# Altium project MB1312.PrjPCB (part 1 of 2)
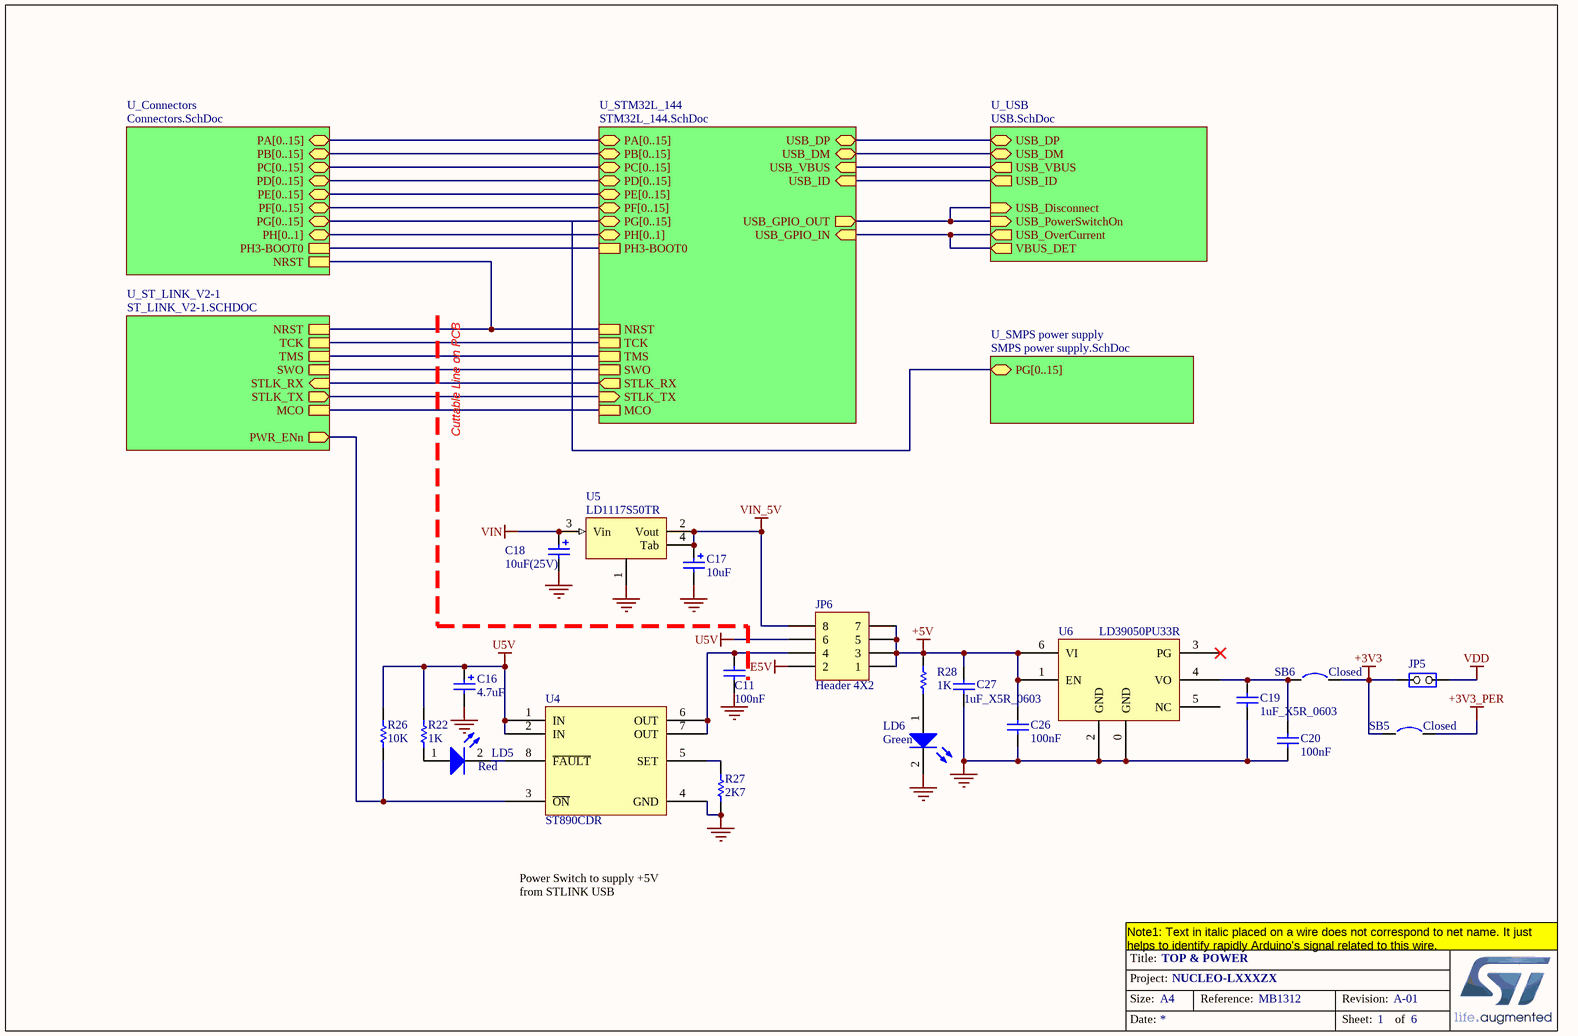
[diagram p0: MB1312.SchDoc]
6 sheets, 297 parts. Net scope: hierarchical (ports join the sheet entries above them; power ports are global).
Sheets:
  MB1312.SchDoc
    U_STM32L_144 = STM32L_144.SchDoc
    U_Connectors = Connectors.SchDoc
    U_ST_LINK_V2-1 = ST_LINK_V2-1.SCHDOC
    U_USB = USB.SchDoc
    U_SMPS power supply = SMPS power supply.SchDoc

## Sheet MB1312.SchDoc: TOP & POWER
size A4; DocumentNumber: MB1312; Revision: A-01; SheetNumber: 1; SheetTotal: 6; Project: NUCLEO-LXXXZX

### Parts
C11  100nF  [0603C]
C16  4.7uF  [TAN-A]
C17  10uF  [TAN-A]
C18  10uF(25V)  [TAN-B]
C19  1uF_X5R_0603  [0603C]
C20  100nF  [0603C]
C26  100nF  [0603C]
C27  1uF_X5R_0603  [0603C]
JP5  (no value)  [HDR_1x2_2R54_V_M_S]
JP6  Header 4X2  [HDR_4x2_2R54_V_M]
LD5  Red  [0603D-R]
LD6  Green  [0603D-G]
R22  1K  [0603R]
R26  10K  [0603R]
R27  2K7  [0603R]
R28  1K  [0603R]
SB5  Closed  [SB_0603]
SB6  Closed  [SB_0603]
U4  ST890CDR  [SOIC8_1R27_4R9X6]
U5  LD1117S50TR  [SOT-223]
U6  LD39050PU33R  [DFN6_0R95_3x3_TP]

### Sub-sheets
U_Connectors = Connectors.SchDoc: PA[0..15] (bidir), PB[0..15] (bidir), PC[0..15] (bidir), NRST, PH3-BOOT0, PD[0..15] (bidir), PE[0..15] (bidir), PF[0..15] (bidir), PG[0..15] (bidir), PH[0..1] (bidir)
U_SMPS power supply = SMPS power supply.SchDoc: PG[0..15] (bidir)
U_ST_LINK_V2-1 = ST_LINK_V2-1.SCHDOC: TMS, TCK, MCO, NRST, STLK_RX (in), STLK_TX (out), SWO, PWR_ENn (out)
U_STM32L_144 = STM32L_144.SchDoc: NRST, MCO, STLK_TX (in), STLK_RX (out), PA[0..15] (bidir), PB[0..15] (bidir), PC[0..15] (bidir), TCK, TMS, SWO, PH3-BOOT0, PD[0..15] (bidir), PE[0..15] (bidir), PF[0..15] (bidir), PG[0..15] (bidir), PH[0..1] (bidir), USB_DM (bidir), USB_DP (bidir), USB_GPIO_OUT (out), USB_GPIO_IN (in), USB_ID (in), USB_VBUS (in)
U_USB = USB.SchDoc: USB_PowerSwitchOn (in), USB_OverCurrent (out), USB_DM (bidir), USB_DP (bidir), USB_ID (out), USB_VBUS (out), USB_Disconnect (in), VBUS_DET (out)

### Nets
+3V3: JP5.1(COMMON) SB5.1 SB6.2
+3V3_PER: SB5.2
+5V: C26.2 C27.1 JP6.1 JP6.3 JP6.5 JP6.7 R28.2 U6.1(EN) U6.6(VI)
E5V: JP6.2
GND: C11.1 C16.2 C17.2 C18.2 C19.2 C20.1 C26.1 C27.2 LD6.2(K) R27.1 U4.4(GND) U5.1 U6.0(GND) U6.2(GND)
U5V: C16.1 JP6.6 R22.1 R26.1 U4.1(IN) U4.2(IN)
VDD: JP5.2(NO)
VIN: C18.1 U5.3(Vin)
VIN_5V: C17.1 JP6.8 U5.2(Vout) U5.4(Tab)
MCO: sheet U_STM32L_144/MCO, sheet U_ST_LINK_V2-1/MCO
NRST: sheet U_STM32L_144/NRST, sheet U_Connectors/NRST, sheet U_ST_LINK_V2-1/NRST
PA13: sheet U_STM32L_144/TMS, sheet U_ST_LINK_V2-1/TMS
PA14: sheet U_STM32L_144/TCK, sheet U_ST_LINK_V2-1/TCK
PB3: sheet U_STM32L_144/SWO, sheet U_ST_LINK_V2-1/SWO
PG6: sheet U_STM32L_144/USB_GPIO_OUT, sheet U_USB/USB_PowerSwitchOn, sheet U_USB/USB_Disconnect
PH3-BOOT0: sheet U_STM32L_144/PH3-BOOT0, sheet U_Connectors/PH3-BOOT0
NetC11_2: C11.2 JP6.4 U4.6(OUT) U4.7(OUT)
NetC19_1: C19.1 C20.2 SB6.1 U6.4(VO)
NetC42_1: sheet U_STM32L_144/USB_VBUS, sheet U_USB/USB_VBUS
NetCN6_1: sheet U_STM32L_144/STLK_RX, sheet U_ST_LINK_V2-1/STLK_RX
NetCN6_2: sheet U_STM32L_144/STLK_TX, sheet U_ST_LINK_V2-1/STLK_TX
NetCN14_2: sheet U_STM32L_144/USB_DM, sheet U_USB/USB_DM
NetCN14_3: sheet U_STM32L_144/USB_DP, sheet U_USB/USB_DP
NetCN14_4: sheet U_STM32L_144/USB_ID, sheet U_USB/USB_ID
NetJP4_1: sheet U_STM32L_144/USB_GPIO_IN, sheet U_USB/USB_OverCurrent, sheet U_USB/VBUS_DET
NetLD5_1: LD5.1(A) R22.2
NetLD5_2: LD5.2(K) U4.8(~{FAULT})
NetLD6_1: LD6.1(A) R28.1
NetR26_2: R26.2 U4.3(~{ON}) ; sheet U_ST_LINK_V2-1/PWR_ENn
NetR27_2: R27.2 U4.5(SET)

Not connected (* = marked no-connect by the designer): U6 3(PG)* 5(NC)

### Buses and harness runs
bus sheet U_Connectors/PA[0..15] = sheet U_STM32L_144/PA[0..15]
bus sheet U_Connectors/PB[0..15] = sheet U_STM32L_144/PB[0..15]
bus sheet U_Connectors/PC[0..15] = sheet U_STM32L_144/PC[0..15]
bus sheet U_Connectors/PD[0..15] = sheet U_STM32L_144/PD[0..15]
bus sheet U_Connectors/PE[0..15] = sheet U_STM32L_144/PE[0..15]
bus sheet U_Connectors/PF[0..15] = sheet U_STM32L_144/PF[0..15]
bus sheet U_Connectors/PG[0..15] = sheet U_SMPS power supply/PG[0..15] = sheet U_STM32L_144/PG[0..15]
bus sheet U_Connectors/PH[0..1] = sheet U_STM32L_144/PH[0..1]

### Notes on the sheet
- Cuttable Line on PCB
- Power Switch to supply +5V from STLINK USB
- Note1: Text in italic placed on a wire does not correspond to net name. It just helps to identify rapidly Arduino's signal related to this wire.
- Title:
- Project:
- Size:
- Date:
- A4
- Reference:
- Sheet:
- Revision:
- of

### Library data of the parts
C11 C20 C26 = Capacitor_ST: Capacitor 0402 / 0603 / 0805; Revision: July-2002: Re-released for DXP Platform.; Value: 100nF
C16 = Cap Pol1: Polarized Capacitor (Radial); Value: 100pF; Ordered by: Subcon; Published: 8-Jun-2000; Revision: July-2002: Re-released for DXP Platform.; Publisher: Altium Limited
C17 C18 = Cap Pol1: Polarized Capacitor (Radial); Published: 8-Jun-2000; Revision: July-2002: Re-released for DXP Platform.; Publisher: Altium Limited; Value: 10uF
C19 C27 = CAP SMD 0603  X5R 1µF 25V 10%: 0603  X5R 1µF; Rated voltage: 25V; Tolerance: 10%; Manufacturer: *; Manufacturer P/N: *; Order code Farnell: 1288202RL; Value: 1µF; Power: *; Technology: X5R; Temperature  Factor: *; Temperature Max: +125°C; Temperature Min: -55°C; STS Code: *
JP5 = JP2
JP6 = Header 4X2: Header, 4-Pin, Dual row; Revision: 17-Jul-2002: Re-released for DXP Platform.; Publisher: Altium Limited
LD5 LD6 = LED2: Typical RED, GREEN, YELLOW, AMBER GaAs LED; Published: 8-Jun-2000; Revision: July-2002: Re-released for DXP Platform.; Publisher: Altium Limited
R22 = Res1: Resistor; Ordered by: Subcon; Published: 8-Jun-2000; Revision: July-2002: Re-released for DXP Platform.; Publisher: Altium Limited; Value: 1K
R26 = Resistor_ST: Resistor 0402 / 0603 / 0805; Description: Resistor 0402 or 0603 or 0805; Value: 10K
R27 R28 = Resistor_ST: Resistor 0402 / 0603 / 0805; Description: Resistor 0402 or 0603 or 0805; Value: 10K
SB5 SB6 = Circuit Breaker_close: Circuit Breaker; Published: 24-Mar-1999; Revision: July-2002: Re-released for DXP Platform.; Publisher: Altium Limited
U5 = LD1117
U6 = LD39050P

## Sheet STM32L_144.SchDoc: MCU
size A3; DocumentNumber: MB1312; Revision: A-01; SheetNumber: 2; SheetTotal: 6; Project: NUCLEO-LXXXZX
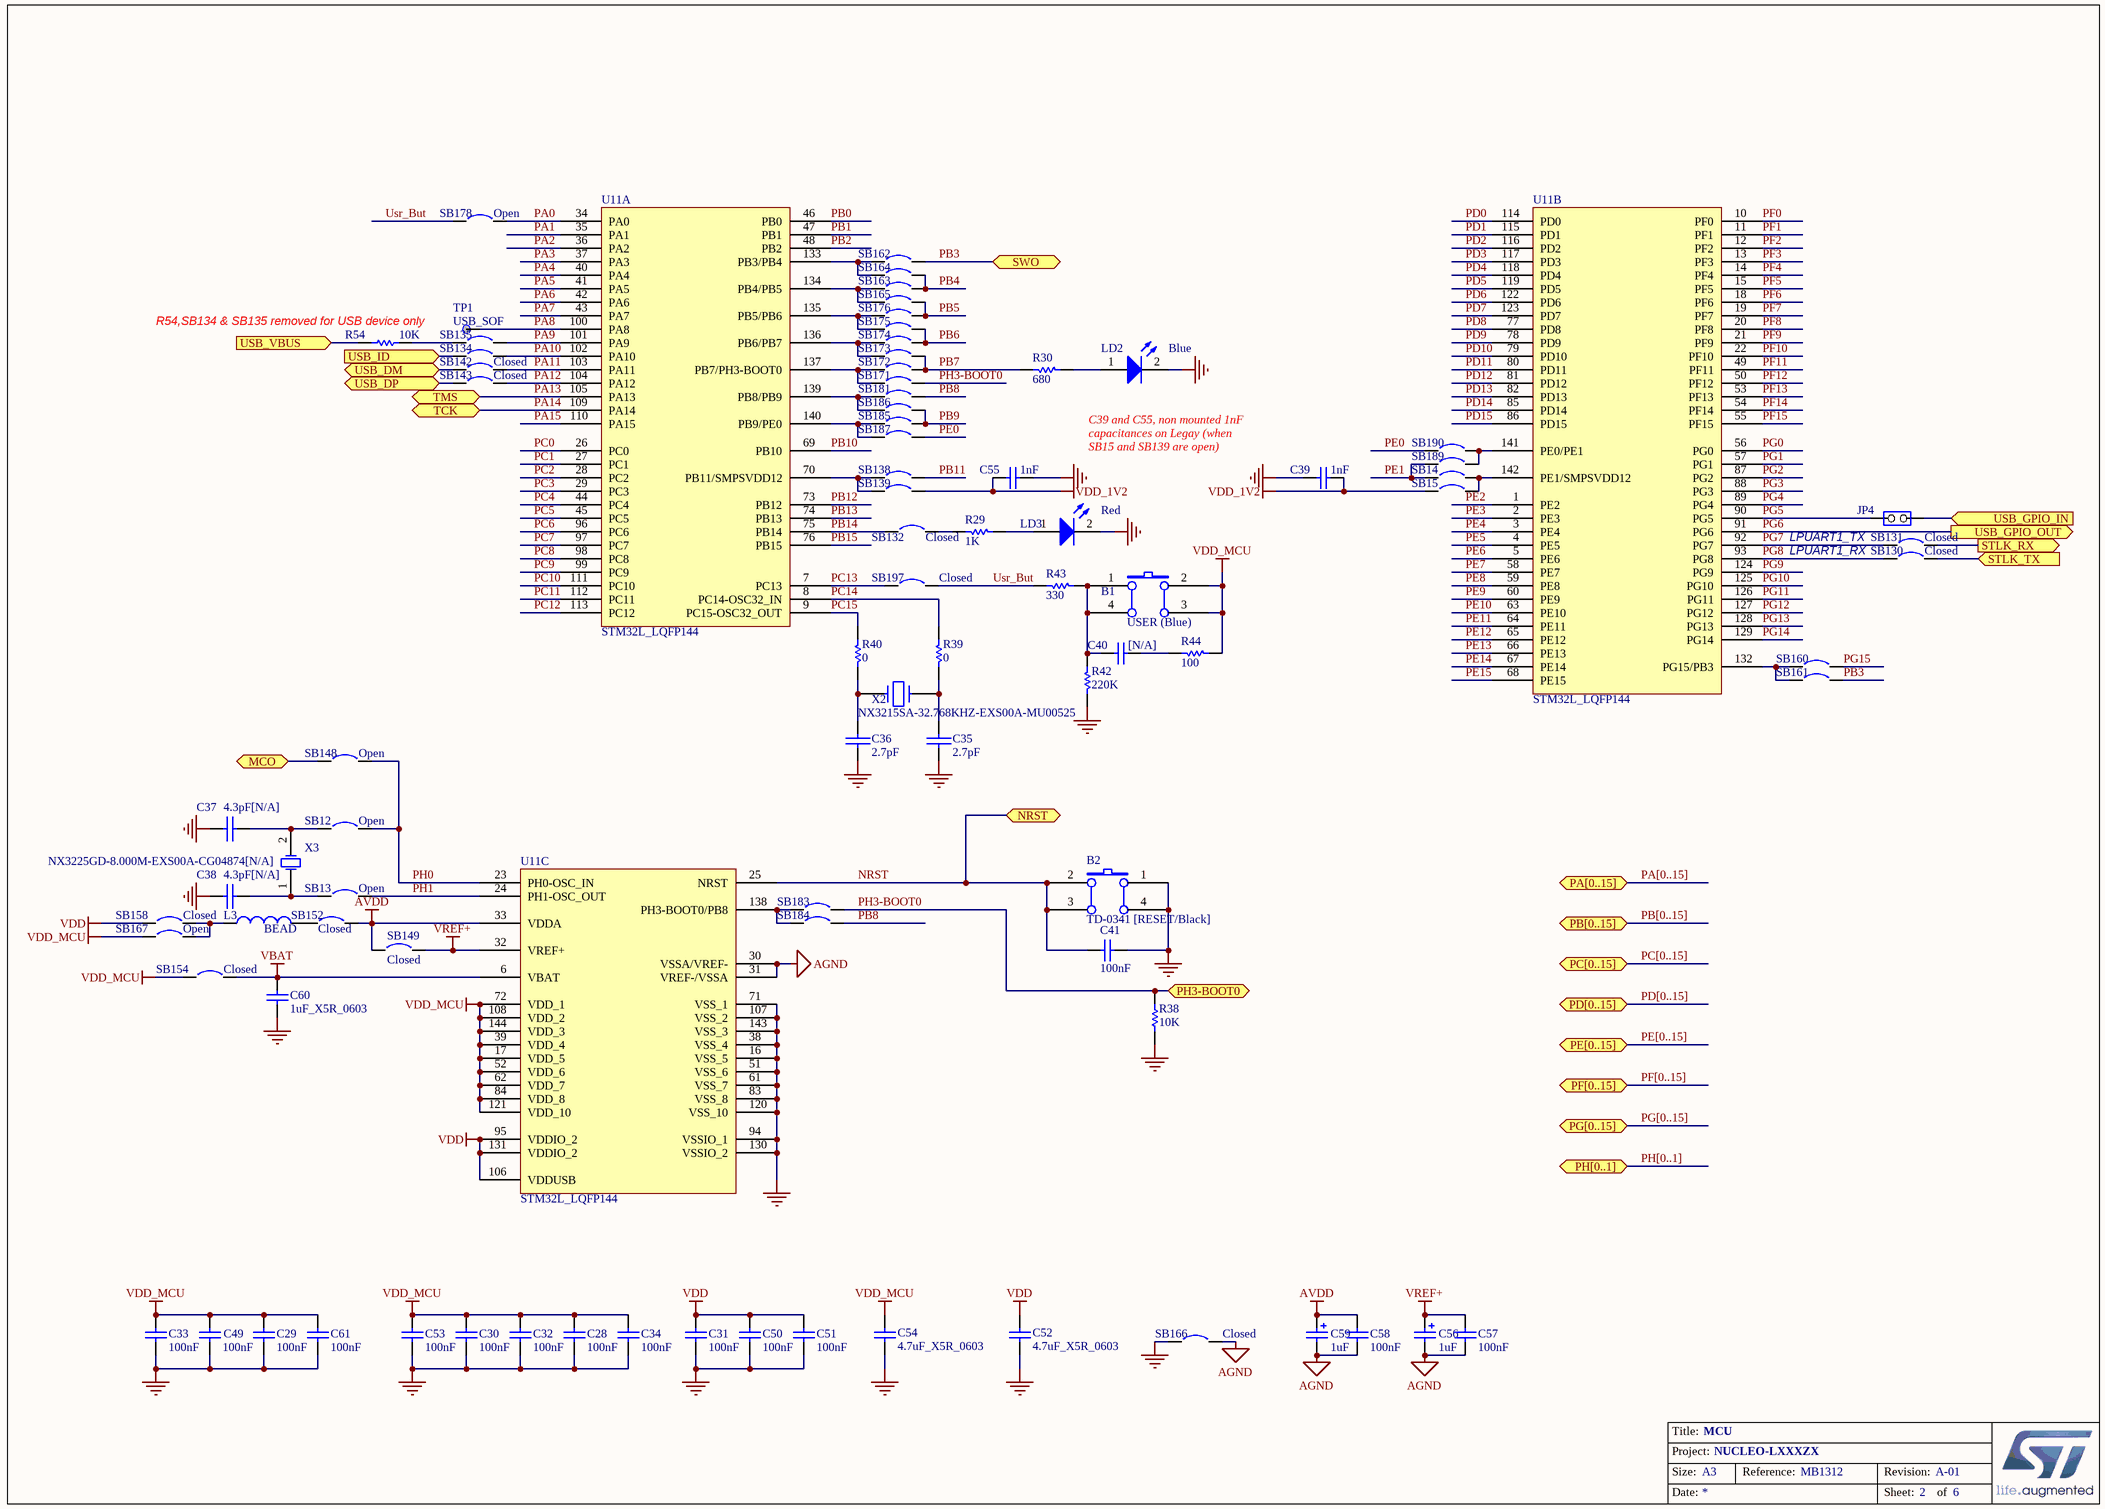
[diagram p1: STM32L_144.SchDoc]

### Parts
B1  USER (Blue)  [PB-6X6mm-Blue]
B2  TD-0341 [RESET/Black]  [PB-6X6mm-Black]
C28  100nF  [0603C]
C29  100nF  [0603C]
C30  100nF  [0603C]
C31  100nF  [0603C]
C32  100nF  [0603C]
C33  100nF  [0603C]
C34  100nF  [0603C]
C35  2.7pF  [0603C]
C36  2.7pF  [0603C]
C37  4.3pF[N/A]  [0603C]
C38  4.3pF[N/A]  [0603C]
C39  1nF  [0603C]
C40  [N/A]  [0603C]
C41  100nF  [0603C]
C49  100nF  [0603C]
C50  100nF  [0603C]
C51  100nF  [0603C]
C52  4.7uF_X5R_0603  [0603C]
C53  100nF  [0603C]
C54  4.7uF_X5R_0603  [0603C]
C55  1nF  [0603C]
C56  value 1uF  [TAN-A]  (hidden comment: TAJA105K016R)
C57  100nF  [0603C]
C58  100nF  [0603C]
C59  value 1uF  [TAN-A]  (hidden comment: TAJA105K016R)
C60  1uF_X5R_0603  [0603C]
C61  100nF  [0603C]
JP4  (no value)  [HDR_1x2_2R54_V_M_S]
L3  BEAD  [0603L]
LD2  Blue  [0603D-B]
LD3  Red  [0603D-R]
R29  1K  [0603R]
R30  680  [0603R]
R38  10K  [0603R]
R39  0  [0603R]
R40  0  [0603R]
R42  220K  [0603R]
R43  330  [0603R]
R44  100  [0603R]
R54  10K  [0603R]
SB12  Open  [SB_0603]
SB13  Open  [SB_0603]
SB14  Circuit Breaker  [SB_0603]  (value not drawn)
SB15  Circuit Breaker  [SB_0603]  (value not drawn)
SB130  Closed  [SB_0603]
SB131  Closed  [SB_0603]
SB132  Closed  [SB_0603]
SB134  Circuit Breaker  [SB_0603]  (value not drawn)
SB135  Circuit Breaker  [SB_0603]  (value not drawn)
SB138  Circuit Breaker  [SB_0603]  (value not drawn)
SB139  Circuit Breaker  [SB_0603]  (value not drawn)
SB142  Closed  [SB_0603]
SB143  Closed  [SB_0603]
SB148  Open  [SB_0603]
SB149  Closed  [SB_0603]
SB152  Closed  [SB_0603]
SB154  Closed  [SB_0603]
SB158  Closed  [SB_0603]
SB160  Circuit Breaker  [SB_0603]  (value not drawn)
SB161  Circuit Breaker  [SB_0603]  (value not drawn)
SB162  Circuit Breaker  [SB_0603]  (value not drawn)
SB163  Circuit Breaker  [SB_0603]  (value not drawn)
SB164  Circuit Breaker  [SB_0603]  (value not drawn)
SB165  Circuit Breaker  [SB_0603]  (value not drawn)
SB166  Closed  [SB_0603]
SB167  Open  [SB_0603]
SB171  Circuit Breaker  [SB_0603]  (value not drawn)
SB172  Circuit Breaker  [SB_0603]  (value not drawn)
SB173  Circuit Breaker  [SB_0603]  (value not drawn)
SB174  Circuit Breaker  [SB_0603]  (value not drawn)
SB175  Circuit Breaker  [SB_0603]  (value not drawn)
SB176  Circuit Breaker  [SB_0603]  (value not drawn)
SB178  Open  [SB_0603]
SB181  Circuit Breaker  [SB_0603]  (value not drawn)
SB183  Circuit Breaker  [SB_0603]  (value not drawn)
SB184  Circuit Breaker  [SB_0603]  (value not drawn)
SB185  Circuit Breaker  [SB_0603]  (value not drawn)
SB186  Circuit Breaker  [SB_0603]  (value not drawn)
SB187  Circuit Breaker  [SB_0603]  (value not drawn)
SB189  Circuit Breaker  [SB_0603]  (value not drawn)
SB190  Circuit Breaker  [SB_0603]  (value not drawn)
SB197  Closed  [SB_0603]
TP1  USB_SOF  [TP]
U11  STM32L_LQFP144  [LQFP144_0R5_SKT]  (parts A,B,C of 3)
X2  NX3215SA-32.768KHZ-EXS00A-MU00525  [XTAL_2SM_3R2X1R5]
X3  NX3225GD-8.000M-EXS00A-CG04874[N/A]  [OSC_2SM_3R2x2R5]

### Ports
MCO, NRST, PA[0..15] (bidir), PB[0..15] (bidir), PC[0..15] (bidir), PD[0..15] (bidir), PE[0..15] (bidir), PF[0..15] (bidir), PG[0..15] (bidir), PH3-BOOT0, PH[0..1] (bidir), STLK_RX (out), STLK_TX (in), SWO, TCK, TMS, USB_DM (bidir), USB_DP (bidir), USB_GPIO_IN (in), USB_GPIO_OUT (out), USB_ID (in), USB_VBUS (in)

### Nets
AGND: C56.2 C57.2 C58.2 C59.2 SB166.2 U11.30(VSSA/VREF-) U11.31(VREF-/VSSA)
AVDD: C58.1 C59.1 SB149.1 SB152.2 U11.33(VDDA)
GND: B2.1(A0) B2.4(A1) C28.2 C29.2 C30.2 C31.2 C32.2 C33.2 C34.2 C35.2 C36.2 C37.2 C38.2 C39.1 C41.1 C49.2 C50.2 C51.2 C52.2 C53.2 C54.2 C55.1 C60.2 C61.2 LD2.2(K) LD3.2(K) R38.2 R42.2 SB166.1 U11.16(VSS_5) U11.38(VSS_4) U11.51(VSS_6) U11.61(VSS_7) U11.71(VSS_1) U11.83(VSS_8) U11.94(VSSIO_1) U11.107(VSS_2) U11.120(VSS_10) U11.130(VSSIO_2) U11.143(VSS_3)
VBAT: C60.1 SB154.2 U11.6(VBAT)
VDD: C31.1 C50.1 C51.1 C52.1 SB158.1 U11.95(VDDIO_2) U11.106(VDDUSB) U11.131(VDDIO_2)
VDD_1V2: C39.2 C55.2 SB15.2 SB139.2
VDD_MCU: B1.2(B0) B1.3(B1) C28.1 C29.1 C30.1 C32.1 C33.1 C34.1 C49.1 C53.1 C54.1 C61.1 R44.1 SB154.1 SB167.1 U11.17(VDD_5) U11.39(VDD_4) U11.52(VDD_6) U11.62(VDD_7) U11.72(VDD_1) U11.84(VDD_8) U11.108(VDD_2) U11.121(VDD_10) U11.144(VDD_3)
VREF+: C56.1 C57.1 SB149.2 U11.32(VREF+)
MCO: SB148.2 ; port MCO
NRST: B2.2(B0) B2.3(B1) C41.2 U11.25(NRST) ; port NRST
PA0: SB178.2 U11.34(PA0)
PA1: U11.35(PA1)
PA2: U11.36(PA2)
PA3: U11.37(PA3)
PA4: U11.40(PA4)
PA5: U11.41(PA5)
PA6: U11.42(PA6)
PA7: U11.43(PA7)
PA8: TP1.1 U11.100(PA8)
PA9: SB135.2 U11.101(PA9)
PA10: SB134.2 U11.102(PA10)
PA11: SB142.2 U11.103(PA11)
PA12: SB143.2 U11.104(PA12)
PA13: U11.105(PA13) ; port TMS
PA14: U11.109(PA14) ; port TCK
PA15: U11.110(PA15)
PB0: U11.46(PB0)
PB1: U11.47(PB1)
PB2: U11.48(PB2)
PB3: SB161.2 SB162.2 ; port SWO
PB4: SB163.2 SB164.2
PB5: SB165.2 SB176.2
PB6: SB174.2 SB175.2
PB7: R30.1 SB172.2 SB173.2
PB8: SB181.2 SB184.2
PB9: SB185.2 SB186.2
PB10: U11.69(PB10)
PB11: SB138.2
PB12: U11.73(PB12)
PB13: U11.74(PB13)
PB14: SB132.1 U11.75(PB14)
PB15: U11.76(PB15)
PC0: U11.26(PC0)
PC1: U11.27(PC1)
PC2: U11.28(PC2)
PC3: U11.29(PC3)
PC4: U11.44(PC4)
PC5: U11.45(PC5)
PC6: U11.96(PC6)
PC7: U11.97(PC7)
PC8: U11.98(PC8)
PC9: U11.99(PC9)
PC10: U11.111(PC10)
PC11: U11.112(PC11)
PC12: U11.113(PC12)
PC13: SB197.1 U11.7(PC13)
PC14: R39.2 U11.8(PC14-OSC32_IN)
PC15: R40.2 U11.9(PC15-OSC32_OUT)
PD0: U11.114(PD0)
PD1: U11.115(PD1)
PD2: U11.116(PD2)
PD3: U11.117(PD3)
PD4: U11.118(PD4)
PD5: U11.119(PD5)
PD6: U11.122(PD6)
PD7: U11.123(PD7)
PD8: U11.77(PD8)
PD9: U11.78(PD9)
PD10: U11.79(PD10)
PD11: U11.80(PD11)
PD12: U11.81(PD12)
PD13: U11.82(PD13)
PD14: U11.85(PD14)
PD15: U11.86(PD15)
PE0: SB187.2 SB190.1
PE1: SB14.1 SB189.1
PE2: U11.1(PE2)
PE3: U11.2(PE3)
PE4: U11.3(PE4)
PE5: U11.4(PE5)
PE6: U11.5(PE6)
PE7: U11.58(PE7)
PE8: U11.59(PE8)
PE9: U11.60(PE9)
PE10: U11.63(PE10)
PE11: U11.64(PE11)
PE12: U11.65(PE12)
PE13: U11.66(PE13)
PE14: U11.67(PE14)
PE15: U11.68(PE15)
PF0: U11.10(PF0)
PF1: U11.11(PF1)
PF2: U11.12(PF2)
PF3: U11.13(PF3)
PF4: U11.14(PF4)
PF5: U11.15(PF5)
PF6: U11.18(PF6)
PF7: U11.19(PF7)
PF8: U11.20(PF8)
PF9: U11.21(PF9)
PF10: U11.22(PF10)
PF11: U11.49(PF11)
PF12: U11.50(PF12)
PF13: U11.53(PF13)
PF14: U11.54(PF14)
PF15: U11.55(PF15)
PG0: U11.56(PG0)
PG1: U11.57(PG1)
PG2: U11.87(PG2)
PG3: U11.88(PG3)
PG4: U11.89(PG4)
PG5: JP4.2(NO) U11.90(PG5)
PG6: U11.91(PG6) ; port USB_GPIO_OUT
PG7: SB131.1 U11.92(PG7)
PG8: SB130.1 U11.93(PG8)
PG9: U11.124(PG9)
PG10: U11.125(PG10)
PG11: U11.126(PG11)
PG12: U11.127(PG12)
PG13: U11.128(PG13)
PG14: U11.129(PG14)
PG15: SB160.2
PH0: SB12.2 SB148.1 U11.23(PH0-OSC_IN)
PH1: SB13.2 U11.24(PH1-OSC_OUT)
PH3-BOOT0: R38.1 SB171.2 SB183.2 ; port PH3-BOOT0
Usr_But: R43.2 SB178.1 SB197.2
NetB1_1: B1.1(A0) B1.4(A1) C40.2 R42.1 R43.1
NetC35_1: C35.1 R39.1 X2.2
NetC36_1: C36.1 R40.1 X2.1
NetC37_1: C37.1 SB12.1 X3.2(OSC2)
NetC38_1: C38.1 SB13.1 X3.1(OSC1)
NetC40_1: C40.1 R44.2
NetC42_1: R54.1 ; port USB_VBUS
NetCN6_1: SB131.2 ; port STLK_RX
NetCN6_2: SB130.2 ; port STLK_TX
NetCN14_2: SB142.1 ; port USB_DM
NetCN14_3: SB143.1 ; port USB_DP
NetCN14_4: SB134.1 ; port USB_ID
NetJP4_1: JP4.1(COMMON) ; port USB_GPIO_IN
NetL3_1: L3.1 SB158.2 SB167.2
NetL3_2: L3.2 SB152.1
NetLD2_1: LD2.1(A) R30.2
NetLD3_1: LD3.1(A) R29.2
NetR29_1: R29.1 SB132.2
NetR54_2: R54.2 SB135.1
NetSB14_2: SB14.2 SB15.1 U11.142(PE1/SMPSVDD12)
NetSB138_1: SB138.1 SB139.1 U11.70(PB11/SMPSVDD12)
NetSB160_1: SB160.1 SB161.1 U11.132(PG15/PB3)
NetSB162_1: SB162.1 SB164.1 U11.133(PB3/PB4)
NetSB163_1: SB163.1 SB165.1 U11.134(PB4/PB5)
NetSB171_1: SB171.1 SB172.1 U11.137(PB7/PH3-BOOT0)
NetSB173_1: SB173.1 SB174.1 U11.136(PB6/PB7)
NetSB175_1: SB175.1 SB176.1 U11.135(PB5/PB6)
NetSB181_1: SB181.1 SB186.1 U11.139(PB8/PB9)
NetSB183_1: SB183.1 SB184.1 U11.138(PH3-BOOT0/PB8)
NetSB185_1: SB185.1 SB187.1 U11.140(PB9/PE0)
NetSB189_2: SB189.2 SB190.2 U11.141(PE0/PE1)

### Buses and harness runs
bus PA[0..15] = port PA[0..15]
bus PB[0..15] = port PB[0..15]
bus PC[0..15] = port PC[0..15]
bus PD[0..15] = port PD[0..15]
bus PE[0..15] = port PE[0..15]
bus PF[0..15] = port PF[0..15]
bus PG[0..15] = port PG[0..15]
bus PH[0..1] = port PH[0..1]

### Notes on the sheet
- (near R54) R54,SB134 & SB135 removed for USB device only
- C39 and C55, non mounted 1nF capacitances on Legay (when SB15 and SB139 are open)
- LPUART1_TX
- LPUART1_RX
- Title:
- Project:
- Size:
- Date:
- A3
- Reference:
- Sheet:
- Revision:
- of

### Library data of the parts
B1 B2 = SW PUSHBUTTON: SE PUSHBUTTON
C28-C34 C39 C49-C51 C53 C55 C57 C58 C61 = Cap: Capacitor; Value: 10nF; Published: 8-Jun-2000; Revision: July-2002: Re-released for DXP Platform.; Publisher: Altium Limited
C35-C38 = CAP: Capacitor
C40 C41 = CAP: Capacitor; Value: 100pF; Published: 8-Jun-2000; Revision: July-2002: Re-released for DXP Platform.; Publisher: Altium Limited
C52 C54 = CAP SMD 0603  X5R 1µF 25V 10%: 0603  X5R 4.7uF; Value: 1µF; Rated voltage: 25V; Tolerance: 10%; Manufacturer: *; Manufacturer P/N: *; Order code Farnell: 1288202RL; Power: *; Technology: X5R; Temperature  Factor: *; Temperature Max: +125°C; Temperature Min: -55°C; STS Code: *
C56 C59 = Cap Pol1: Tan Capacitor,1uF,10%,16V,Tan-A,TAJA105K016R; Manuf_1: AVX; Ordered by: Subcon; ECCN_US/EU: NA; Published: 8-Jun-2000; Revision: July-2002: Re-released for DXP Platform.; Publisher: Altium Limited; Manuf_Part_1: TAJA105K016R
C60 = CAP SMD 0603  X5R 1µF 25V 10%: as C19 on sheet MB1312; Manufacturer: *; Manufacturer P/N: *; Order code Farnell: 1288202RL; Value: 1µF; Power: *; Technology: X5R; Temperature  Factor: *; Temperature Max: +125°C; Temperature Min: -55°C; STS Code: *
JP4 = JP2
L3 = Inductor: Value: 100uH; Published: 8-Jun-2000; Revision: July-2002: Re-released for DXP Platform.; Publisher: Altium Limited
LD2 LD3 = LED2: as LD5 on sheet MB1312; Published: 8-Jun-2000; Revision: July-2002: Re-released for DXP Platform.; Publisher: Altium Limited
R29 = Res1: Resistor; Published: 8-Jun-2000; Revision: July-2002: Re-released for DXP Platform.; Publisher: Altium Limited; Value: 1K
R30 R39 R40 R43 R44 = Res1: Resistor; Value: 1K; Published: 8-Jun-2000; Revision: July-2002: Re-released for DXP Platform.; Publisher: Altium Limited
R38 R42 = res1: Resistor; Value: 1K; Published: 8-Jun-2000; Revision: July-2002: Re-released for DXP Platform.; Publisher: Altium Limited
R54 = Resistor_ST: Resistor 0402 / 0603 / 0805; Value: 10K
SB12 SB13 SB148 SB167 SB178 = Circuit Breaker: Published: 24-Mar-1999; Revision: July-2002: Re-released for DXP Platform.; Publisher: Altium Limited
SB14 SB15 SB134 SB135 SB138 SB139 SB160-SB165 SB171-SB176 SB181 SB183-SB187 SB189 SB190 = Circuit Breaker: Solder: NO; Published: 24-Mar-1999; Revision: July-2002: Re-released for DXP Platform.; Publisher: Altium Limited
SB130-SB132 SB142 SB143 SB149 SB152 SB154 SB158 SB166 SB197 = Circuit Breaker_close: Circuit Breaker; Published: 24-Mar-1999; Revision: July-2002: Re-released for DXP Platform.; Publisher: Altium Limited
TP1 = TP
X2 = CRYSTAL_32K: Crystal
X3 = XTAL: Crystal Oscillator; Published: 8-Jun-2000; LatestRevisionDate: 17-Jul-2002; LatestRevisionNote: Re-released for DXP Platform.; PackageReference: R38; Publisher: Altium Limited

## Sheet Connectors.SchDoc: Extension connectors
size A3; DocumentNumber: MB1312; Revision: A-01; SheetNumber: 5; SheetTotal: 6; Project: NUCLEO-LXXXZX
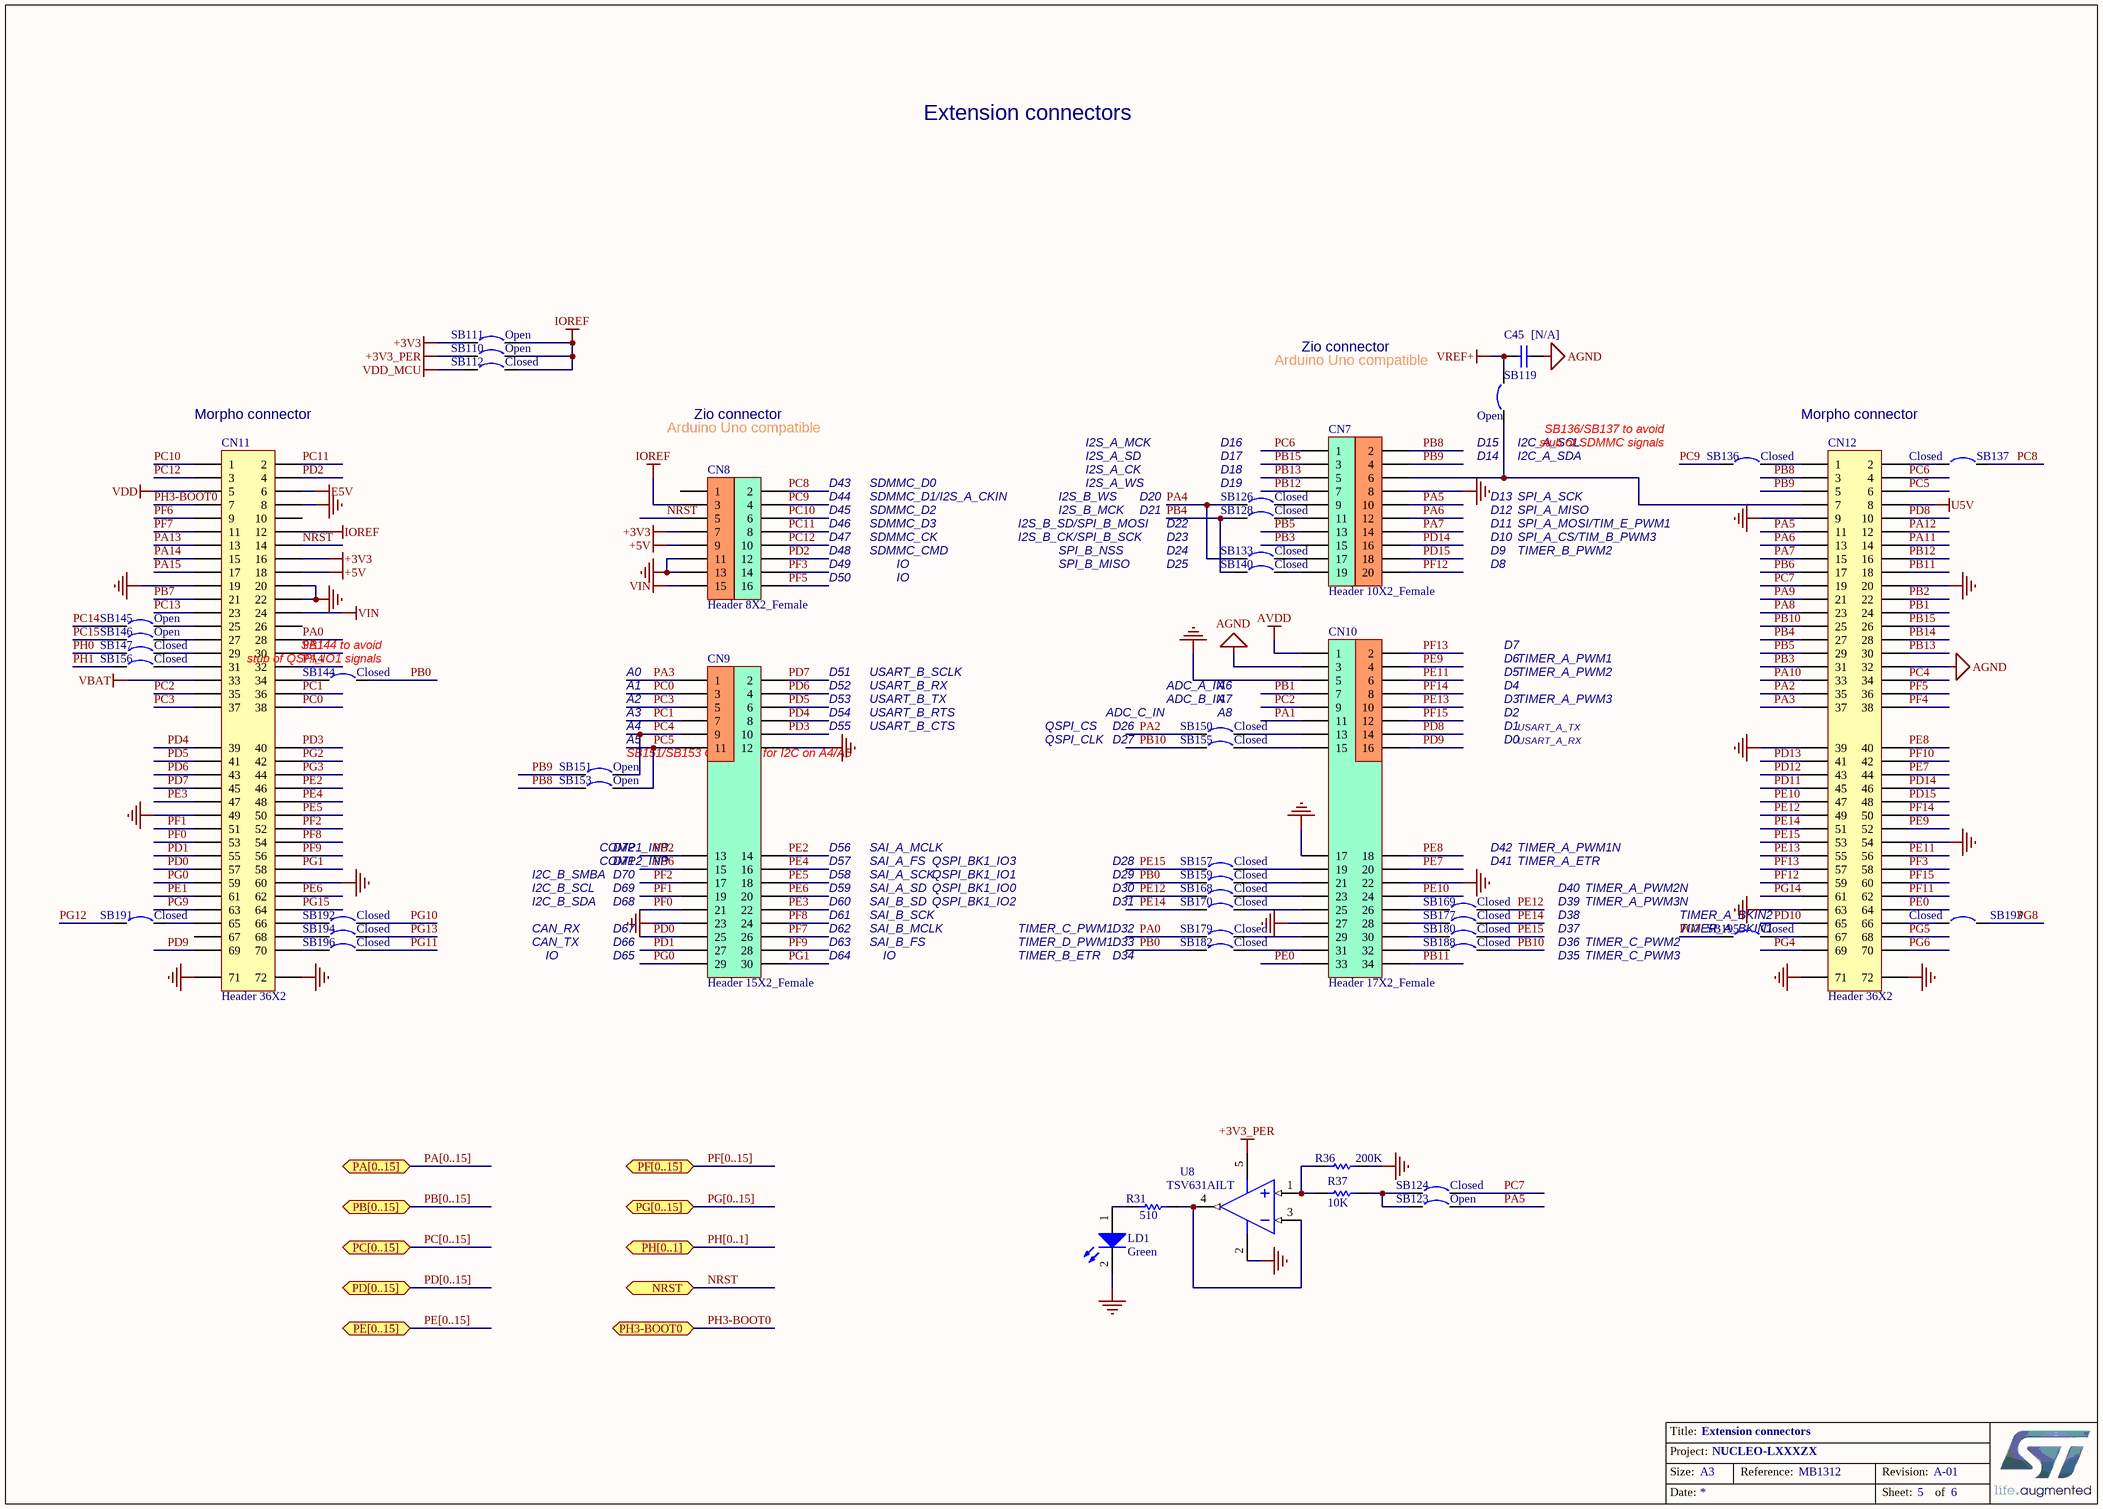
[diagram p2: Connectors.SchDoc]

### Parts
C45  [N/A]  [0603C]
CN7  Header 10X2_Female  [HDR_10x2_2R54_V_F]
CN8  Header 8X2_Female  [HDR_8x2_2R54_V_F]
CN9  Header 15X2_Female  [HDR_15x2_2R54_V_F]
CN10  Header 17X2_Female  [HDR_17x2_2R54_V_F]
CN11  Header 36X2  [HDR_2x36_2R54_V_M]
CN12  Header 36X2  [HDR_2x36_2R54_V_M]
LD1  Green  [0603D-G]
R31  510  [0603R]
R36  200K  [0603R]
R37  10K  [0603R]
SB110  Open  [SB_0603]
SB111  Open  [SB_0603]
SB112  Closed  [SB_0603]
SB119  Open  [SB_0603]
SB123  Open  [SB_0603]
SB124  Closed  [SB_0603]
SB126  Closed  [SB_0603]
SB128  Closed  [SB_0603]
SB133  Closed  [SB_0603]
SB136  Closed  [SB_0603]
SB137  Closed  [SB_0603]
SB140  Closed  [SB_0603]
SB144  Closed  [SB_0603]
SB145  Open  [SB_0603]
SB146  Open  [SB_0603]
SB147  Closed  [SB_0603]
SB150  Closed  [SB_0603]
SB151  Open  [SB_0603]
SB153  Open  [SB_0603]
SB155  Closed  [SB_0603]
SB156  Closed  [SB_0603]
SB157  Closed  [SB_0603]
SB159  Closed  [SB_0603]
SB168  Closed  [SB_0603]
SB169  Closed  [SB_0603]
SB170  Closed  [SB_0603]
SB177  Closed  [SB_0603]
SB179  Closed  [SB_0603]
SB180  Closed  [SB_0603]
SB182  Closed  [SB_0603]
SB188  Closed  [SB_0603]
SB191  Closed  [SB_0603]
SB192  Closed  [SB_0603]
SB193  Closed  [SB_0603]
SB194  Closed  [SB_0603]
SB195  Closed  [SB_0603]
SB196  Closed  [SB_0603]
U8  TSV631AILT  [SOT-23-5L]

### Ports
NRST, PA[0..15] (bidir), PB[0..15] (bidir), PC[0..15] (bidir), PD[0..15] (bidir), PE[0..15] (bidir), PF[0..15] (bidir), PG[0..15] (bidir), PH3-BOOT0, PH[0..1] (bidir)

### Nets
+3V3: CN8.7 CN11.16 SB111.1
+3V3_PER: SB110.1 U8.5(VCC)
+5V: CN8.9 CN11.18
AGND: C45.2 CN10.3 CN12.32
AVDD: CN10.1
E5V: CN11.6
GND: CN7.8 CN8.11 CN8.13 CN9.12 CN9.23 CN10.5 CN10.17 CN10.22 CN10.27 CN11.8 CN11.19 CN11.20 CN11.22 CN11.49 CN11.60 CN11.71 CN11.72 CN12.9 CN12.20 CN12.39 CN12.54 CN12.63 CN12.71 CN12.72 LD1.2(K) R36.2 U8.2(VDD)
IOREF: CN8.3 CN11.12 SB110.2 SB111.2 SB112.2
U5V: CN12.8
VBAT: CN11.33
VDD: CN11.5
VDD_MCU: SB112.1
VIN: CN8.15 CN11.24
VREF+: C45.1 SB119.1
NRST: CN8.5 CN11.14 ; port NRST
PA0: CN11.28 SB179.1
PA1: CN10.11 CN11.30
PA2: CN12.35 SB150.1
PA3: CN9.1 CN12.37
PA4: CN11.32 SB126.1 SB133.1
PA5: CN7.10 CN12.11 SB123.2
PA6: CN7.12 CN12.13
PA7: CN7.14 CN12.15
PA8: CN12.23
PA9: CN12.21
PA10: CN12.33
PA11: CN12.14
PA12: CN12.12
PA13: CN11.13
PA14: CN11.15
PA15: CN11.17
PB0: SB144.2 SB159.1 SB182.1
PB1: CN10.7 CN12.24
PB2: CN9.13 CN12.22
PB3: CN7.15 CN12.31
PB4: CN12.27 SB128.1 SB140.1
PB5: CN7.13 CN12.29
PB6: CN9.15 CN12.17
PB7: CN11.21
PB8: CN7.2 CN12.3 SB153.2
PB9: CN7.4 CN12.5 SB151.2
PB10: CN12.25 SB155.1 SB188.2
PB11: CN10.34 CN12.18
PB12: CN7.7 CN12.16
PB13: CN7.5 CN12.30
PB14: CN12.28
PB15: CN7.3 CN12.26
PC0: CN9.3 CN11.38
PC1: CN9.7 CN11.36
PC2: CN10.9 CN11.35
PC3: CN9.5 CN11.37
PC4: CN9.9 CN12.34 SB151.1
PC5: CN9.11 CN12.6 SB153.1
PC6: CN7.1 CN12.4
PC7: CN12.19 SB124.1
PC8: CN8.2 SB137.1
PC9: CN8.4 SB136.1
PC10: CN8.6 CN11.1
PC11: CN8.8 CN11.2
PC12: CN8.10 CN11.3
PC13: CN11.23
PC14: SB145.1
PC15: SB146.1
PD0: CN9.25 CN11.57
PD1: CN9.27 CN11.55
PD2: CN8.12 CN11.4
PD3: CN9.10 CN11.40
PD4: CN9.8 CN11.39
PD5: CN9.6 CN11.41
PD6: CN9.4 CN11.43
PD7: CN9.2 CN11.45
PD8: CN10.14 CN12.10
PD9: CN10.16 CN11.69
PD10: CN12.65
PD11: CN12.45
PD12: CN12.43
PD13: CN12.41
PD14: CN7.16 CN12.46
PD15: CN7.18 CN12.48
PE0: CN10.33 CN12.64
PE1: CN11.61
PE2: CN9.14 CN11.46
PE3: CN9.22 CN11.47
PE4: CN9.16 CN11.48
PE5: CN9.18 CN11.50
PE6: CN9.20 CN11.62
PE7: CN10.20 CN12.44
PE8: CN10.18 CN12.40
PE9: CN10.4 CN12.52
PE10: CN10.24 CN12.47
PE11: CN10.6 CN12.56
PE12: CN12.49 SB168.1 SB169.2
PE13: CN10.10 CN12.55
PE14: CN12.51 SB170.1 SB177.2
PE15: CN12.53 SB157.1 SB180.2
PF0: CN9.21 CN11.53
PF1: CN9.19 CN11.51
PF2: CN9.17 CN11.52
PF3: CN8.14 CN12.58
PF4: CN12.38
PF5: CN8.16 CN12.36
PF6: CN11.9
PF7: CN9.26 CN11.11
PF8: CN9.24 CN11.54
PF9: CN9.28 CN11.56
PF10: CN12.42
PF11: CN12.62
PF12: CN7.20 CN12.59
PF13: CN10.2 CN12.57
PF14: CN10.8 CN12.50
PF15: CN10.12 CN12.60
PG0: CN9.29 CN11.59
PG1: CN9.30 CN11.58
PG2: CN11.42
PG3: CN11.44
PG4: CN12.69
PG5: CN12.68
PG6: CN12.70
PG7: SB195.1
PG8: SB193.2
PG9: CN11.63
PG10: SB192.2
PG11: SB196.2
PG12: SB191.1
PG13: SB194.2
PG14: CN12.61
PG15: CN11.64
PH0: SB147.1
PH1: SB156.1
PH3-BOOT0: CN11.7 ; port PH3-BOOT0
NetCN7_6: CN7.6 CN12.7 SB119.2
NetCN7_9: CN7.9 SB126.2
NetCN7_11: CN7.11 SB128.2
NetCN7_17: CN7.17 SB133.2
NetCN7_19: CN7.19 SB140.2
NetCN10_13: CN10.13 SB150.2
NetCN10_15: CN10.15 SB155.2
NetCN10_19: CN10.19 SB157.2
NetCN10_21: CN10.21 SB159.2
NetCN10_23: CN10.23 SB168.2
NetCN10_25: CN10.25 SB170.2
NetCN10_26: CN10.26 SB169.1
NetCN10_28: CN10.28 SB177.1
NetCN10_29: CN10.29 SB179.2
NetCN10_30: CN10.30 SB180.1
NetCN10_31: CN10.31 SB182.2
NetCN10_32: CN10.32 SB188.1
NetCN11_25: CN11.25 SB145.2
NetCN11_27: CN11.27 SB146.2
NetCN11_29: CN11.29 SB147.2
NetCN11_31: CN11.31 SB156.2
NetCN11_34: CN11.34 SB144.1
NetCN11_65: CN11.65 SB191.2
NetCN11_66: CN11.66 SB192.1
NetCN11_68: CN11.68 SB194.1
NetCN11_70: CN11.70 SB196.1
NetCN12_1: CN12.1 SB136.2
NetCN12_2: CN12.2 SB137.2
NetCN12_66: CN12.66 SB193.1
NetCN12_67: CN12.67 SB195.2
NetLD1_1: LD1.1(A) R31.2
NetR31_1: R31.1 U8.3(IN-) U8.4(OUT)
NetR36_1: R36.1 R37.1 U8.1(IN+)
NetR37_2: R37.2 SB123.1 SB124.2

Not connected (* = marked no-connect by the designer): CN8 1; CN11 10 26 67

### Buses and harness runs
bus PA[0..15] = port PA[0..15]
bus PB[0..15] = port PB[0..15]
bus PC[0..15] = port PC[0..15]
bus PD[0..15] = port PD[0..15]
bus PE[0..15] = port PE[0..15]
bus PF[0..15] = port PF[0..15]
bus PG[0..15] = port PG[0..15]
bus PH[0..1] = port PH[0..1]

### Notes on the sheet
- Extension connectors
- Arduino Uno compatible
- Zio connector
- (near CN11) Morpho connector
- I2S_A_MCK
- D16
- (near SB119) D15
- (near SB119) I2C_A_SCL
- (near SB136) SB136/SB137 to avoid
- (near SB136) stub of SDMMC signals
- Morpho connector
- D43
- D44
- D45
- SDMMC_D0
- SDMMC_D1/I2S_A_CKIN
- SDMMC_D2
- I2S_B_WS
- I2S_B_MCK
- I2S_A_SD
- I2S_A_CK
- I2S_A_WS
- D20
- D21
- D17
- D18
- (near SB126) D19
- (near SB119) D14
- D13
- D12
- SPI_A_SCK
- SPI_A_MISO
- (near SB119) I2C_A_SDA
- D46
- D47
- D48
- D49
- D50
- SDMMC_CK
- SDMMC_CMD
- SDMMC_D3
- IO
- I2S_B_SD/SPI_B_MOSI
- I2S_B_CK/SPI_B_SCK
- SPI_B_MISO
- SPI_B_NSS
- D22
- D23
- D24
- D25
- D8
- D9
- D10
- D11
- TIMER_B_PWM2
- SPI_A_CS/TIM_B_PWM3
- SPI_A_MOSI/TIM_E_PWM1
- (near SB144) SB144 to avoid
- D7
- (near SB144) stub of QSPI_IO1 signals
- A0
- A1
- A2
- A3
- D51
- D52
- D53
- D54
- USART_B_TX
- USART_B_RX
- USART_B_SCLK
- USART_B_RTS
- ADC_A_IN
- ADC_B_IN
- (near SB150) ADC_C_IN
- A6
- A7
- (near SB150) A8
- D2
- D4
- D3
- D5
- D6
- TIMER_A_PWM1
- TIMER_A_PWM2
- TIMER_A_PWM3
- A4
- A5
- (near SB151) SB151/SB153 Close only for I2C on A4/A5
- D55
- USART_B_CTS
- QSPI_CLK
- QSPI_CS
- D26
- D27
- D0
- D1
- USART_A_TX
- USART_A_RX
- COMP1_INP
- D72
- D56
- SAI_A_MCLK
- D42
- TIMER_A_PWM1N
- I2C_B_SCL
- I2C_B_SDA
- I2C_B_SMBA
- COMP2_INP
- D71
- D70
- D69
- D68
- D57
- D58
- D59
- D60
- D61
- SAI_A_SD
- SAI_A_SCK
- SAI_A_FS
- SAI_B_SD
- SAI_B_SCK
- QSPI_BK1_IO0
- QSPI_BK1_IO2
- QSPI_BK1_IO1
- QSPI_BK1_IO3
- D28
- D29
- D30
- D31
- D41
- TIMER_A_ETR
- D38
- D39
- D40
- TIMER_A_PWM2N
- TIMER_A_PWM3N
- TIMER_A_BKIN2
- CAN_TX
- CAN_RX
- D67
- D66
- D65
- D62
- D63
- D64
- SAI_B_FS
- SAI_B_MCLK
- TIMER_D_PWM1
- TIMER_B_ETR
- TIMER_C_PWM1
- D32
- D33
- D34
- D35
- D36
- D37
- TIMER_C_PWM2
- TIMER_C_PWM3
- TIMER_A_BKIN1
- Title:
- Project:
- Size:
- Date:
- Reference:
- Sheet:
- Revision:
- of

### Library data of the parts
C45 = Cap: Capacitor,100nF,10%,16V,X7R,0603,YAGEO; Manuf_Part_1: CC0603KRX7R7BB104; Ordered by: Subcon; Published: 8-Jun-2000; Revision: July-2002: Re-released for DXP Platform.; Publisher: Altium Limited; Value: 100nF; Manuf_1: YAGEO
CN7 = Header 10X2_Female: Header, 10-Pin, Dual row,female; LatestRevisionDate: 17-Jul-2002; LatestRevisionNote: Re-released for DXP Platform.; Publisher: Altium Limited
CN8 = Header 8X2_Female: Header, 8-Pin, Dual row,female; LatestRevisionDate: 17-Jul-2002; LatestRevisionNote: Re-released for DXP Platform.; Publisher: Altium Limited
CN9 = Header 15X2_Female: Header, 15-Pin, Dual row,female; Revision: 17-Jul-2002: Re-released for DXP Platform.; Publisher: Altium Limited
CN10 = Header 17X2_Female: Header, 17-Pin, Dual row,female; Revision: 17-Jul-2002: Re-released for DXP Platform.; Publisher: Altium Limited
CN11 CN12 = Header 36X2: Header, 36-Pin, Dual row; Revision: 17-Jul-2002: Re-released for DXP Platform.; Publisher: Altium Limited
LD1 = LED2: as LD5 on sheet MB1312; Published: 8-Jun-2000; Revision: July-2002: Re-released for DXP Platform.; Publisher: Altium Limited
R31 = Res1: Resistor; Value: 1K; Published: 8-Jun-2000; Revision: July-2002: Re-released for DXP Platform.; Publisher: Altium Limited
R36 R37 = res1: Resistor; Value: 1K; Published: 8-Jun-2000; Revision: July-2002: Re-released for DXP Platform.; Publisher: Altium Limited
SB110 SB111 SB119 SB123 SB145 SB146 SB151 SB153 = Circuit Breaker: Published: 24-Mar-1999; Revision: July-2002: Re-released for DXP Platform.; Publisher: Altium Limited
SB112 SB124 SB126 SB128 SB133 SB136 SB137 SB140 SB144 SB147 SB150 SB155-SB157 SB159 SB168-SB170 SB177 SB179 SB180 SB182 SB188 SB191-SB196 = Circuit Breaker_close: Circuit Breaker; Published: 24-Mar-1999; Revision: July-2002: Re-released for DXP Platform.; Publisher: Altium Limited

## Sheet ST_LINK_V2-1.SCHDOC: STLINK/V2-1
size A4; DocumentNumber: MB1312; Revision: A-01; SheetNumber: 3; SheetTotal: 6; Project: NUCLEO-LXXXZX
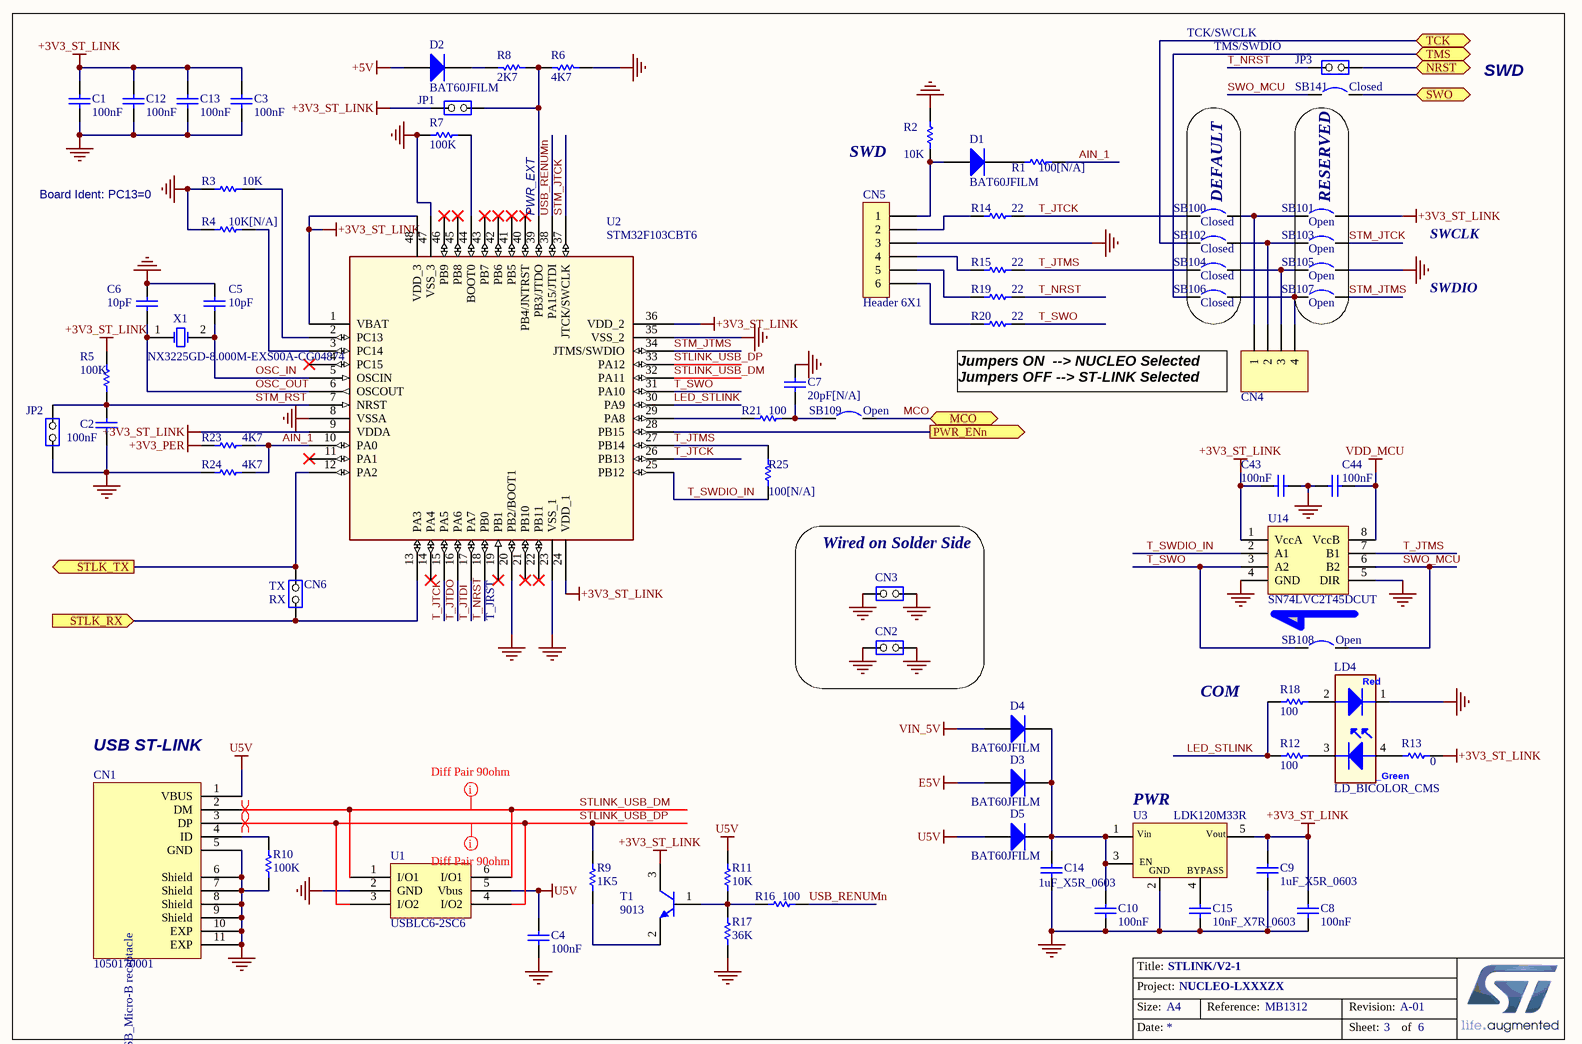
[diagram p3: ST_LINK_V2-1.SCHDOC]

### Parts
C1  100nF  [0603C]
C2  100nF  [0603C]
C3  100nF  [0603C]
C4  100nF  [0603C]
C5  10pF  [0603C]
C6  10pF  [0603C]
C7  20pF[N/A]  [0603C]
C8  100nF  [0603C]
C9  1uF_X5R_0603  [0603C]
C10  100nF  [0603C]
C12  100nF  [0603C]
C13  100nF  [0603C]
C14  1uF_X5R_0603  [0603C]
C15  10nF_X7R_0603  [0603C]
C43  value 100nF  [0603C]  (hidden comment: CC0603KRX7R7BB104)
C44  value 100nF  [0603C]  (hidden comment: CC0603KRX7R7BB104)
CN1  1050170001  [Molex_1050170001]
CN2  (no value)  [HDR_1x2_2R54_V_M]
CN3  (no value)  [HDR_1x2_2R54_V_M]
CN4  Header 4  [HDR_1x4_2R54_V_M]  (value not drawn)
CN5  Header 6X1  [HDR_1x6_2R54_V_M]
CN6  (no value)  [HDR_1x2_2R54_V_M_S]
D1  BAT60JFILM  [SOD-323]
D2  BAT60JFILM  [SOD-323]
D3  BAT60JFILM  [SOD-323]
D4  BAT60JFILM  [SOD-323]
D5  BAT60JFILM  [SOD-323]
JP1  (no value)  [HDR_1x2_2R54_V_M_S]
JP2  (no value)  [HDR_1x2_2R54_V_M_S]
JP3  (no value)  [HDR_1x2_2R54_V_M_S]
LD4  LD_BICOLOR_CMS  [HSMF-A201]
R1  100[N/A]  [0603R]
R2  10K  [0603R]
R3  10K  [0603R]
R4  10K[N/A]  [0603R]
R5  100K  [0603R]
R6  4K7  [0603R]
R7  100K  [0603R]
R8  2K7  [0603R]
R9  1K5  [0603R]
R10  100K  [0603R]
R11  10K  [0603R]
R12  100  [0603R]
R13  0  [0603R]
R14  22  [0603R]
R15  22  [0603R]
R16  100  [0603R]
R17  36K  [0603R]
R18  100  [0603R]
R19  22  [0603R]
R20  22  [0603R]
R21  100  [0603R]
R23  4K7  [0603R]
R24  4K7  [0603R]
R25  100[N/A]  [0603R]
SB100  Closed  [SB_0603]
SB101  Open  [SB_0603]
SB102  Closed  [SB_0603]
SB103  Open  [SB_0603]
SB104  Closed  [SB_0603]
SB105  Open  [SB_0603]
SB106  Closed  [SB_0603]
SB107  Open  [SB_0603]
SB108  Open  [SB_0603]
SB109  Open  [SB_0603]
SB141  Closed  [SB_0603]
T1  9013  [SOT-23]
U1  USBLC6-2SC6  [SOT23-6L]
U2  STM32F103CBT6  [LQFP48_0R5_7x7]
U3  LDK120M33R  [SOT23-5]
U14  SN74LVC2T45DCUT  [USOP8_0R5_2X3R1]
X1  NX3225GD-8.000M-EXS00A-CG04874  [OSC_2SM_3R2x2R5]

### Blocks framed on the sheet
DEFAULT: SB100 SB102 SB104 SB106
RESERVED: SB101 SB103 SB105 SB107
Wired on Solder Side: CN2 CN3

### Ports
MCO, NRST, PWR_ENn (out), STLK_RX (in), STLK_TX (out), SWO, TCK, TMS

### Nets
+3V3_PER: R23.1
+3V3_ST_LINK: C1.2 C3.2 C8.2 C9.1 C12.2 C13.2 C43.2 JP1.1(COMMON) R5.2 R13.2 SB101.2 T1.3(C) U2.1(VBAT) U2.9(VDDA) U2.24(VDD_1) U2.36(VDD_2) U2.48(VDD_3) U3.5(Vout) U14.1(VccA)
+5V: D2.1(A)
E5V: D3.1(A)
GND: C1.1 C2.1 C3.1 C4.1 C5.2 C6.2 C7.2 C8.1 C9.2 C10.1 C12.1 C13.1 C14.1 C15.1 C43.1 C44.2 CN1.5(GND) CN1.6(Shield) CN1.7(Shield) CN1.8(Shield) CN1.9(Shield) CN1.10(EXP) CN1.11(EXP) CN2.1(COMMON) CN2.2(NO) CN3.1(COMMON) CN3.2(NO) CN5.3 JP2.1(COMMON) LD4.1 R2.2 R3.1 R4.1 R6.2 R7.1 R10.2 R17.1 R24.1 SB105.2 U1.2(GND) U2.8(VSSA) U2.20(PB2/BOOT1) U2.23(VSS_1) U2.35(VSS_2) U2.47(VSS_3) U3.2(GND) U14.4(GND) U14.5(DIR)
U5V: C4.2 CN1.1(VBUS) D5.1(A) R11.2 U1.5(Vbus)
VDD_MCU: C44.1 U14.8(VccB)
VIN_5V: D4.1(A)
AIN_1: R1.2 R23.2 R24.2 U2.10(PA0)
LED_STLINK: R12.1 R18.1 U2.30(PA9)
MCO: SB109.1 ; port MCO
NRST: JP3.2(NO) ; port NRST
OSC_IN: C5.1 U2.5(OSCIN) X1.2(OSC2)
OSC_OUT: C6.1 U2.6(OSCOUT) X1.1(OSC1)
PA13: SB106.1 ; port TMS
PA14: SB102.1 ; port TCK
PB3: SB141.2 ; port SWO
STLINK_USB_DM: CN1.2(DM) U1.1(I/O1) U1.6(I/O1) U2.32(PA11)
STLINK_USB_DP: CN1.3(DP) R9.1 U1.3(I/O2) U1.4(I/O2) U2.33(PA12)
STM_JTCK: SB103.2 U2.37(JTCK/SWCLK)
STM_JTMS: SB107.2 U2.34(JTMS/SWDIO)
STM_RST: C2.2 JP2.2(NO) R5.1 U2.7(NRST)
SWO_MCU: SB108.1 SB141.1 U14.6(B2)
T_JTCK: R14.2 SB100.1 U2.15(PA5) U2.26(PB13)
T_JTDI: U2.17(PA7)
T_JTDO: U2.16(PA6)
T_JTMS: R15.2 R25.2 SB104.1 U2.27(PB14) U14.7(B1)
T_NRST: JP3.1(COMMON) R19.2 U2.18(PB0)
T_SWDIO_IN: R25.1 U2.25(PB12) U14.2(A1)
T_SWO: R20.2 SB108.2 U2.31(PA10) U14.3(A2)
USB_RENUMn: R16.2 U2.38(PA15/JTDI)
NetC7_1: C7.1 R21.2 SB109.2
NetC10_2: C10.2 C14.2 D3.2(K) D4.2(K) D5.2(K) U3.1(Vin) U3.3(CE)
NetC15_2: C15.2 U3.4(BYPASS)
NetCN1_4: CN1.4(ID) R10.1
NetCN4_1: CN4.1 SB100.2 SB101.1
NetCN4_2: CN4.2 SB102.2 SB103.1
NetCN4_3: CN4.3 SB104.2 SB105.1
NetCN4_4: CN4.4 SB106.2 SB107.1
NetCN5_1: CN5.1 D1.1(A) R2.1
NetCN5_2: CN5.2 R14.1
NetCN5_4: CN5.4 R15.1
NetCN5_5: CN5.5 R19.1
NetCN5_6: CN5.6 R20.1
NetCN6_1: CN6.1(COMMON) U2.13(PA3) ; port STLK_RX
NetCN6_2: CN6.2(NO) U2.12(PA2) ; port STLK_TX
NetD1_2: D1.2(K) R1.1
NetD2_2: D2.2(K) R8.1
NetJP1_2: JP1.2(NO) R6.1 R8.2 U2.39(PB3/JTDO)
NetLD4_2: LD4.2 R18.2
NetLD4_3: LD4.3 R12.2
NetLD4_4: LD4.4 R13.1
NetR3_2: R3.2 U2.2(PC13)
NetR4_2: R4.2 U2.3(PC14)
NetR7_2: R7.2 U2.44(BOOT0)
NetR9_2: R9.2 T1.2(E)
NetR11_1: R11.1 R16.1 R17.2 T1.1(B)
NetR21_1: R21.1 U2.29(PA8)
NetR26_2: U2.28(PB15) ; port PWR_ENn

Not connected (* = marked no-connect by the designer): U2 4(PC15)* 11(PA1)* 14(PA4)* 19(PB1)* 21(PB10)* 22(PB11)* 40(PB4/JNTRST)* 41(PB5)* 42(PB6)* 43(PB7)* 45(PB8)* 46(PB9)*

### Layout directives
differential pair: (no net found under the mark)
mark named Diff Pair 90ohm: STLINK_USB_DM, STLINK_USB_DP

### Notes on the sheet
- TCK/SWCLK
- TMS/SWDIO
- SWD
- Board Ident: PC13=0
- (near U2) PWR_EXT
- SWCLK
- SWDIO
- Jumpers ON  --> NUCLEO Selected
  Jumpers OFF --> ST-LINK Selected
- (near CN6) TX
- (near CN6) RX
- (near U2) T_JRST
- COM
- (near CN1) USB ST-LINK
- (near U3) PWR
- Title:
- Project:
- Size:
- Date:
- A4
- Reference:
- Sheet:
- Revision:
- of
- (in symbol 1050170001) USB_Micro-B receptacle
- (in symbol LD_BICOLOR_CMS) Red; _Green
- (in symbol LDK120M33R) EN

### Library data of the parts
C1-C4 C8 C10 C12 C13 = Capacitor_ST: Capacitor 0402 / 0603 / 0805; Revision: July-2002: Re-released for DXP Platform.; Value: 100nF
C5-C7 = Capacitor_ST: Capacitor 0402 / 0603 / 0805; Value: 100nF; Revision: July-2002: Re-released for DXP Platform.
C9 C14 = CAP SMD 0603  X5R 1µF 25V 10%: as C19 on sheet MB1312; Manufacturer: *; Manufacturer P/N: *; Order code Farnell: 1288202RL; Value: 1µF; Power: *; Technology: X5R; Temperature  Factor: *; Temperature Max: +125°C; Temperature Min: -55°C; STS Code: *
C15 = CAP SMD 0603  X7R 10000PF 50V 10%: 0603  X7R 10NF; Order code RS: 2040779; Rated voltage: 50V; Tolerance: 10%; Order code Farnell: 7569548RL; Value: 10NF; Power: *; Technology: X7R; Temperature Factor: *; Temperature Min: -55°C; Temperature Max: +125°C; STS Code: *
C43 C44 = Cap: Capacitor,100nF,10%,16V,X7R,0603,YAGEO; Ordered by: Subcon; Published: 8-Jun-2000; Revision: July-2002: Re-released for DXP Platform.; Publisher: Altium Limited; Manuf_1: YAGEO; Manuf_Part_1: CC0603KRX7R7BB104
CN1 = 1050170001: Silkscreen: USB
CN2 CN3 JP1-JP3 = JP2
CN4 = Header 4: Header, 4-Pin, Single row; Revision: 17-Jul-2002: Re-released for DXP Platform.; Publisher: Altium Limited
CN5 = Header 6X1: Header, 6-Pin, Single row; LatestRevisionDate: 17-Jul-2002; LatestRevisionNote: Re-released for DXP Platform.; Publisher: Altium Limited
CN6 = JP2: Fitted: NO
D1 D3-D5 = BAT60JFILM: Manuf_1: STM; Provided: ST; ECCN_US/EU: EAR99/NEC; Revision: July-2002: Re-released for DXP Platform.; Order: BAT60JFILM; Manuf_Part_1: BAT60JFILM; Distrib: ST
D2 = Diode: Default Diode; Code - JEDEC: DO-214-AB; Ordered by: STM; ECCN_US/EU: EAR99/NEC; Published: 8-Jun-2000; Revision: July-2002: Re-released for DXP Platform.; Publisher: Altium Limited
LD4 = LD_BICOLOR_CMS: Bicolor Led; Manuf_Part_1: HSMF-A201-A00J1; Manuf_1: Avago Technologies; Ref St: xxxxxx; cap_dec: ----; Distrib: RADIOSPARES
R1 R5 R7 R9 R10 R12-R16 R18-R21 R25 = Resistor_ST: as R27 on sheet MB1312
R2 R3 = Resistor_ST: as R26 on sheet MB1312; Value: 10K
R4 R23 R24 = Resistor_ST: Resistor 0402 / 0603 / 0805; Description: Resistor 0402 or 0603 or 0805; Value: 10K; Fitted: NO
R6 R8 R11 R17 = Res1: Resistor; Value: 1K; Published: 8-Jun-2000; Revision: July-2002: Re-released for DXP Platform.; Publisher: Altium Limited
SB100 SB102 SB104 SB106 SB141 = Circuit Breaker_close: Circuit Breaker; Published: 24-Mar-1999; Revision: July-2002: Re-released for DXP Platform.; Publisher: Altium Limited
SB101 SB103 SB105 SB107-SB109 = Circuit Breaker: Published: 24-Mar-1999; Revision: July-2002: Re-released for DXP Platform.; Publisher: Altium Limited
T1 = NPN: NPN Bipolar Transistor; Code - JEDEC: TO-226-AA; Published: 8-Jun-2000; Revision: July-2002: Re-released for DXP Platform.; Publisher: Altium Limited
U2 = STM32F103CBT6: Medium-density performance line ARM-based 32-bit MCU with 64KB Flash; Manuf_Part_1: STM32F103C8T6; Manuf_1: STM; Ref St: 9175981; Provided: ST; ECCN_US/EU: 3A991A2/NEC; Footprint: QFP48 7X7; Distrib: ST; Order: STM32F103C8T6
U3 = LDK120M33R: 200 mA low quiescent current very low noise LDO; Manuf_1: STM; Manuf_Part_1: LD3985M33R; Provided: ST; Description: Ultra low drop-low noise BiCMOS voltage, regulators low ESR capacitors compatible; Ref St: 9176161; ECCN_US/EU: EAR99/NEC; Distrib: ST; Order: LD3985M33R
U14 = SN74LVC2T45DCUT: Manuf_1: TI; Ordered by: Subcon; ECCN_US/EU: EAR99/NEC; Manuf_Part_1: SN74LVC2T45DCUT
X1 = XTAL: Crystal Oscillator; Published: 8-Jun-2000; LatestRevisionDate: 17-Jul-2002; LatestRevisionNote: Re-released for DXP Platform.; PackageReference: R38; Publisher: Altium Limited

## Sheet USB.SchDoc: USB
size A4; DocumentNumber: MB1312; Revision: A-01; SheetNumber: 4; SheetTotal: 6; Project: NUCLEO-LXXXZX
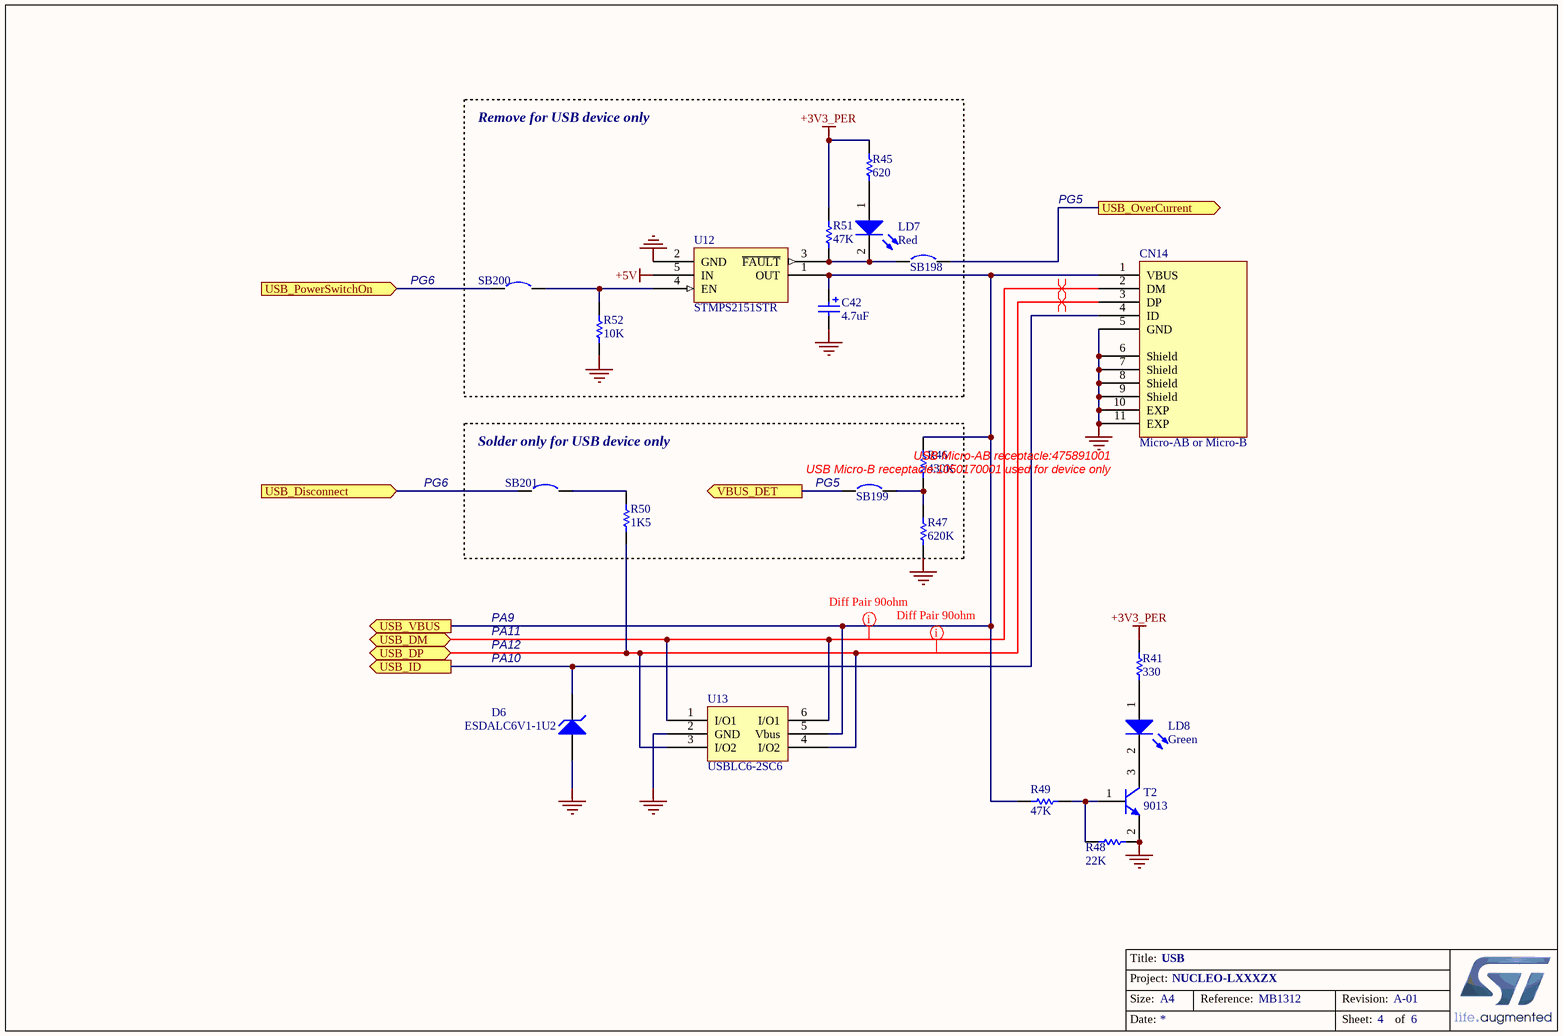
[diagram p4: USB.SchDoc]

### Parts
C42  4.7uF  [TAN-A]
CN14  Micro-AB or Micro-B  [Micro-AB or MicroB]
D6  ESDALC6V1-1U2  [ESDALC6V1-1U2]
LD7  Red  [0603D-R]
LD8  Green  [0603D-G]
R41  330  [0603R]
R45  620  [0603R]
R46  430K  [0603R]
R47  620K  [0603R]
R48  22K  [0603R]
R49  47K  [0603R]
R50  1K5  [0603R]
R51  47K  [0603R]
R52  10K  [0603R]
SB198  Circuit Breaker  [SB_0603]  (value not drawn)
SB199  Circuit Breaker  [SB_0603]  (value not drawn)
SB200  Circuit Breaker  [SB_0603]  (value not drawn)
SB201  Circuit Breaker  [SB_0603]  (value not drawn)
T2  9013  [SOT-23]
U12  STMPS2151STR  [SOT-23-5L]
U13  USBLC6-2SC6  [SOT23-6L]

### Blocks framed on the sheet
Remove for USB device only: C42 LD7 R45 R51 R52 SB198 SB200 U12
Solder only for USB device only: R46 R47 R50 SB199 SB201

### Ports
USB_Disconnect (in), USB_DM (bidir), USB_DP (bidir), USB_ID (out), USB_OverCurrent (out), USB_PowerSwitchOn (in), USB_VBUS (out), VBUS_DET (out)

### Nets
+3V3_PER: R41.2 R45.2 R51.1
+5V: U12.5(IN)
GND: C42.2 CN14.5(GND) CN14.6(Shield) CN14.7(Shield) CN14.8(Shield) CN14.9(Shield) CN14.10(EXP) CN14.11(EXP) D6.2(K) R47.2 R48.1 R52.1 T2.2(E) U12.2(GND) U13.2(GND)
PG6: SB200.1 SB201.1 ; port USB_PowerSwitchOn, port USB_Disconnect
NetC42_1: C42.1 CN14.1(VBUS) R46.1 R49.1 U12.1(OUT) U13.5(Vbus) ; port USB_VBUS
NetCN14_2: CN14.2(DM) U13.1(I/O1) U13.6(I/O1) ; port USB_DM
NetCN14_3: CN14.3(DP) R50.1 U13.3(I/O2) U13.4(I/O2) ; port USB_DP
NetCN14_4: CN14.4(ID) D6.1(A) ; port USB_ID
NetJP4_1: SB198.2 SB199.1 ; port USB_OverCurrent, port VBUS_DET
NetLD7_1: LD7.1(A) R45.1
NetLD7_2: LD7.2(K) R51.2 SB198.1 U12.3(~{FAULT})
NetLD8_1: LD8.1(A) R41.1
NetLD8_2: LD8.2(K) T2.3(C)
NetR46_2: R46.2 R47.1 SB199.2
NetR48_2: R48.2 R49.2 T2.1(B)
NetR50_2: R50.2 SB201.2
NetR52_2: R52.2 SB200.2 U12.4(EN)

### Layout directives
mark named Diff Pair 90ohm: NetCN14_2, NetCN14_3
differential pair: NetCN14_2, NetCN14_3

### Notes on the sheet
- PG5
- PG6
- (near SB199) PG5
- (near CN14) USB Micro-AB receptacle:475891001
- (near CN14) USB Micro-B receptacle:1050170001 used for device only
- PA9
- PA12
- PA11
- PA10
- Title:
- Project:
- Size:
- Date:
- A4
- Reference:
- Sheet:
- Revision:
- of

### Library data of the parts
C42 = Cap Pol1: Polarized Capacitor (Radial); Value: 47uF; Published: 8-Jun-2000; Revision: July-2002: Re-released for DXP Platform.; Publisher: Altium Limited
CN14 = Micro-AB or Micro-B: Silkscreen: USB
D6 = ESDALC6V1-1U2: Zener Diode ESDALC6V1-1U2; Ordered by: STM; Published: 8-Jun-2000; LatestRevisionDate: 17-Jul-2002; LatestRevisionNote: Re-released for DXP Platform.; PackageReference: DIODE-0.7; Publisher: Altium Limited; PackageDescription: Diode, Thru-Hole; 2 Leads; 0.7 in Pin Spacing
LD7 LD8 = LED2: as LD5 on sheet MB1312; Published: 8-Jun-2000; Revision: July-2002: Re-released for DXP Platform.; Publisher: Altium Limited
R41 R46-R49 R51 = res1: Resistor; Value: 1K; Published: 8-Jun-2000; Revision: July-2002: Re-released for DXP Platform.; Publisher: Altium Limited
R45 R52 = Res1: Resistor; Value: 1K; Published: 8-Jun-2000; Revision: July-2002: Re-released for DXP Platform.; Publisher: Altium Limited
R50 = Resistor_ST: as R27 on sheet MB1312
SB198-SB201 = Circuit Breaker: Solder: NO; Published: 24-Mar-1999; Revision: July-2002: Re-released for DXP Platform.; Publisher: Altium Limited
T2 = NPN: as T1 on sheet ST_LINK_V2-1; Published: 8-Jun-2000; Revision: July-2002: Re-released for DXP Platform.; Publisher: Altium Limited
U12 = STMPS2141STR

## Sheet SMPS power supply.SchDoc: SMPS power supply
size A3; DocumentNumber: MB1312; Revision: A-01; SheetNumber: 6; SheetTotal: 6; Project: NUCLEO-LXXXZX
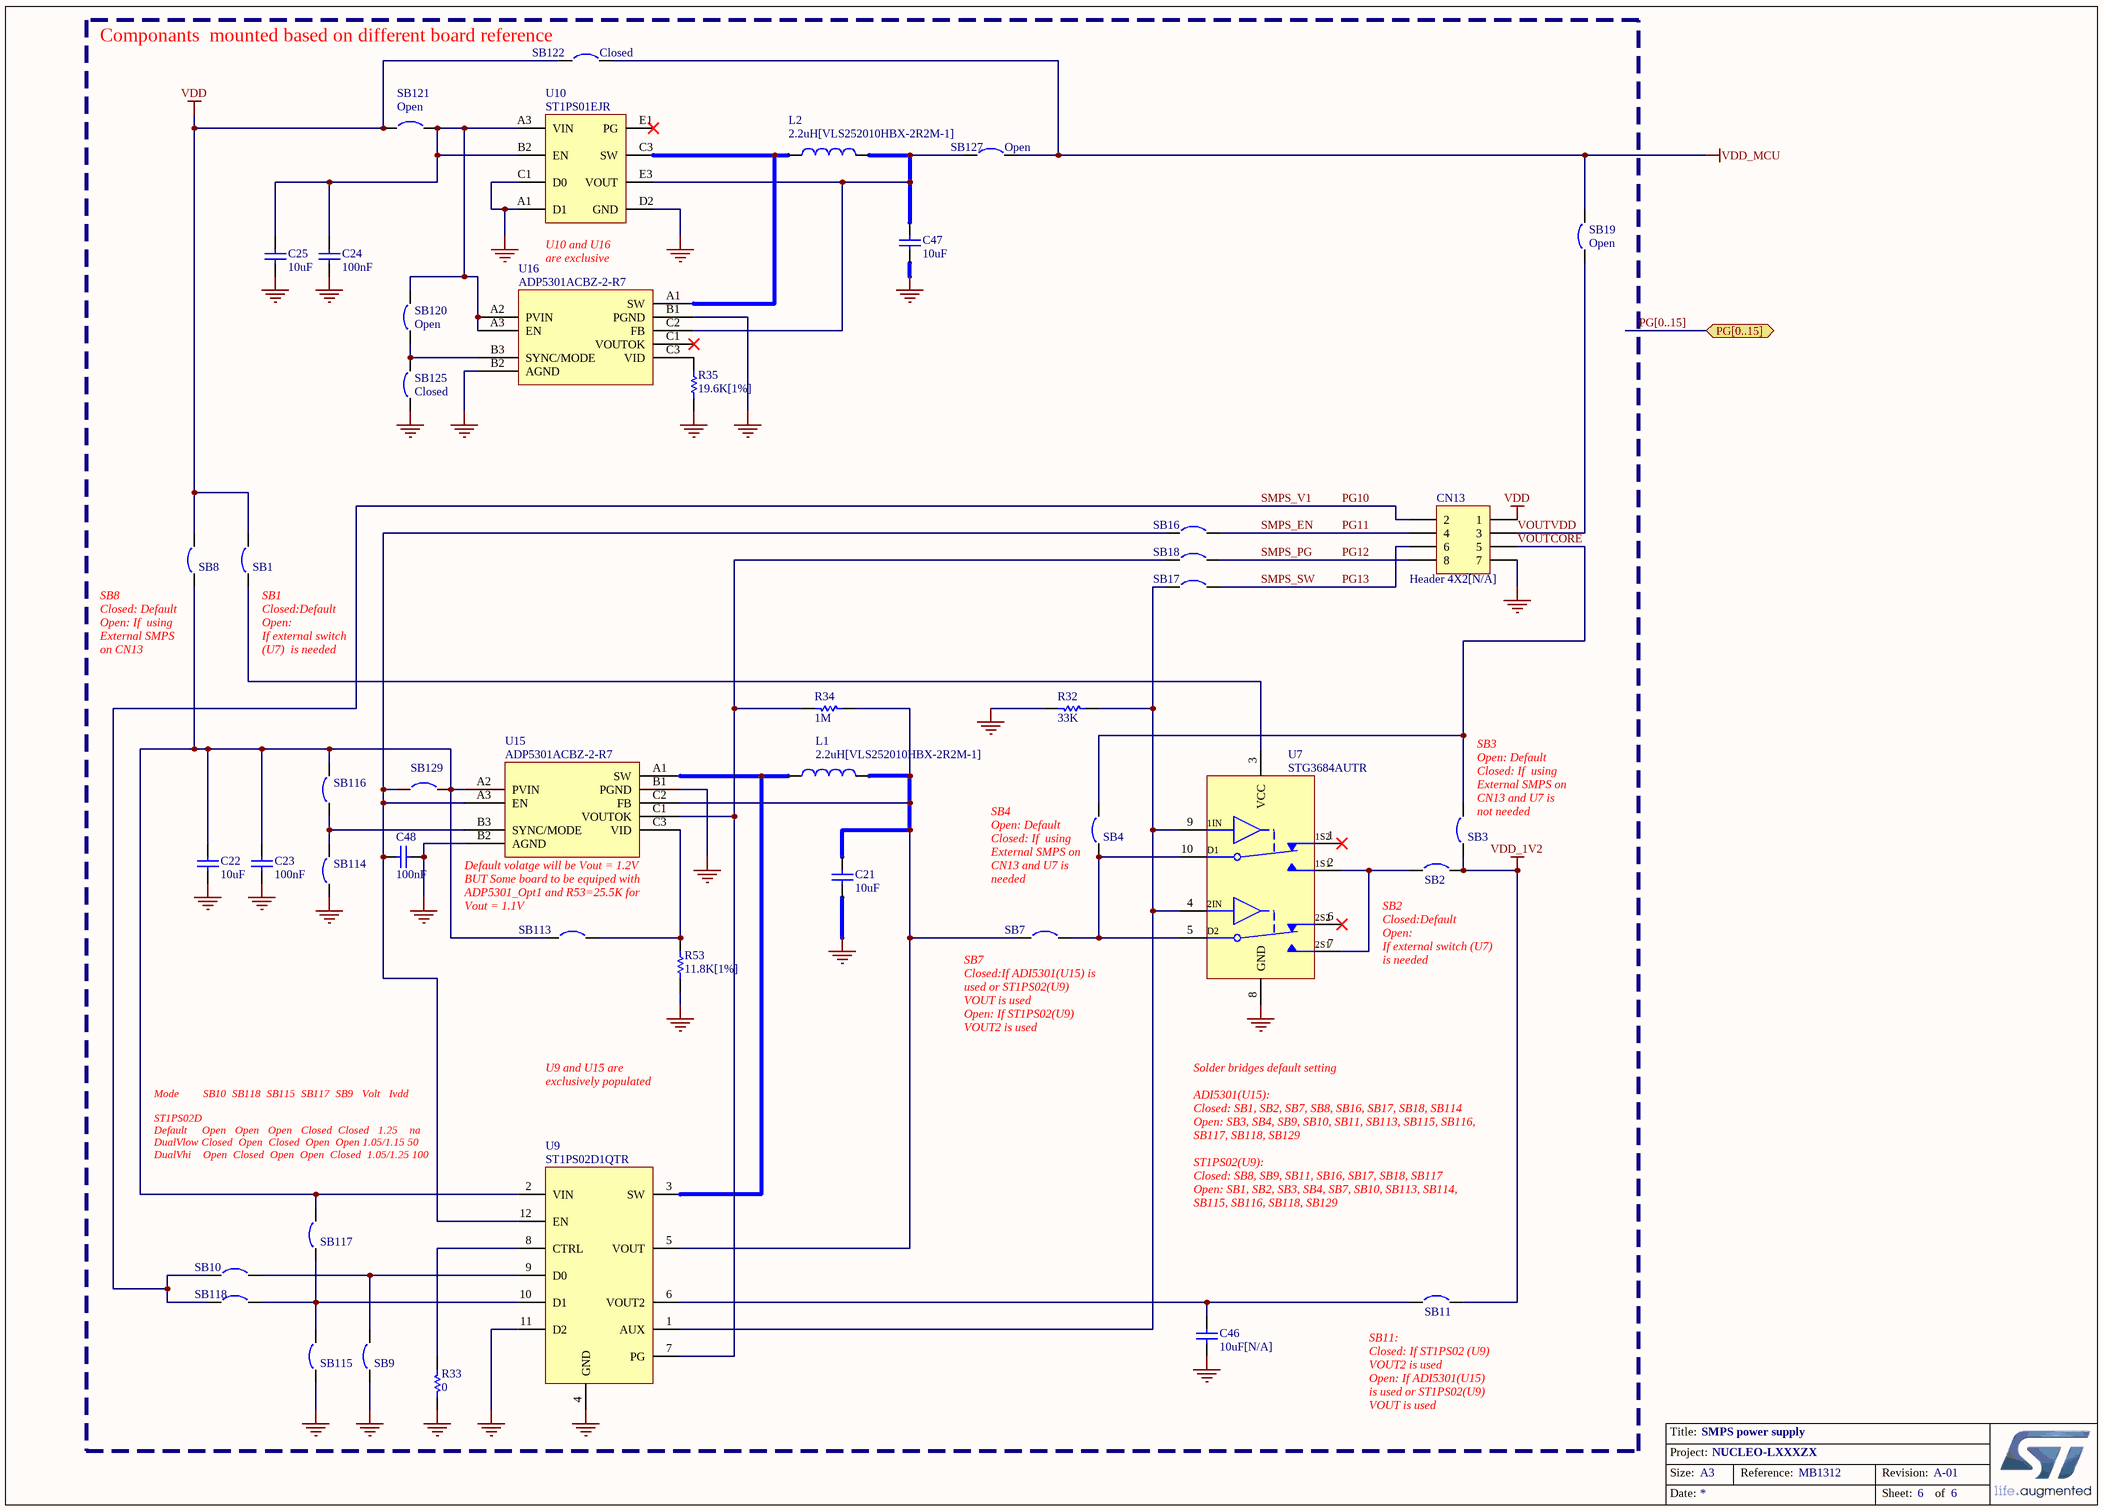
[diagram p5: SMPS power supply.SchDoc]

### Parts
C21  10uF  [0603C]
C22  10uF  [0603C]
C23  100nF  [0603C]
C24  100nF  [0603C]
C25  10uF  [0603C]
C46  10uF[N/A]  [0603C]
C47  10uF  [0603C]
C48  100nF  [0603C]
CN13  Header 4X2[N/A]  [HDR_4x2_2R54_V_M]
L1  2.2uH[VLS252010HBX-2R2M-1]  [L1008_L0805_CPT]
L2  2.2uH[VLS252010HBX-2R2M-1]  [L1008_L0805_CPT]
R32  33K  [0603R]
R33  0  [0603R]
R34  1M  [0603R]
R35  19.6K[1%]  [0603R]
R53  11.8K[1%]  [0603R]
SB1  Circuit Breaker  [SB_0603]  (value not drawn)
SB2  Circuit Breaker  [SB_0603]  (value not drawn)
SB3  Circuit Breaker  [SB_0603]  (value not drawn)
SB4  Circuit Breaker  [SB_0603]  (value not drawn)
SB7  Circuit Breaker  [SB_0603]  (value not drawn)
SB8  Circuit Breaker  [SB_0603]  (value not drawn)
SB9  Circuit Breaker  [SB_0603]  (value not drawn)
SB10  Circuit Breaker  [SB_0603]  (value not drawn)
SB11  Circuit Breaker  [SB_0603]  (value not drawn)
SB16  Circuit Breaker  [SB_0603]  (value not drawn)
SB17  Circuit Breaker  [SB_0603]  (value not drawn)
SB18  Circuit Breaker  [SB_0603]  (value not drawn)
SB19  Open  [SB_0603]
SB113  Open  [SB_0603]  (value not drawn)
SB114  Closed  [SB_0603]  (value not drawn)
SB115  Circuit Breaker  [SB_0603]  (value not drawn)
SB116  Open  [SB_0603]  (value not drawn)
SB117  Circuit Breaker  [SB_0603]  (value not drawn)
SB118  Circuit Breaker  [SB_0603]  (value not drawn)
SB120  Open  [SB_0603]
SB121  Open  [SB_0603]
SB122  Closed  [SB_0603]
SB125  Closed  [SB_0603]
SB127  Open  [SB_0603]
SB129  Open  [SB_0603]  (value not drawn)
U7  STG3684AUTR  [QFN40P180X140X55-10N]
U9  ST1PS02D1QTR  [QFN0P170X200X55-12N]
U10  ST1PS01EJR  [Flipchip8]
U15  ADP5301ACBZ-2-R7  [WLCSP-9ball]
U16  ADP5301ACBZ-2-R7  [WLCSP-9ball]

### Blocks framed on the sheet
Componants  mounted based on different board reference: C21-C25 C46-C48 CN13 L1 L2 R32-R35 R53 SB1-SB4 SB7-SB11 SB16-SB19 SB113-SB118 SB120-SB122 SB125 SB127 SB129 U7 U9 U10 U15 U16

### Ports
PG[0..15] (bidir)

### Nets
GND: C21.1 C22.1 C23.2 C24.2 C25.1 C46.1 C47.1 C48.2 CN13.7 R32.2 R33.1 R35.1 R53.1 SB9.1 SB114.1 SB115.1 SB125.1 U7.8(GND) U9.4(GND) U9.11(D2) U10.A1(D1) U10.C1(D0) U10.D2(GND) U15.B1(PGND) U15.B2(AGND) U16.B1(PGND) U16.B2(AGND)
VDD: CN13.1 SB1.2 SB8.2 SB121.1 SB122.1
VDD_1V2: SB2.2 SB3.1 SB11.2
VDD_MCU: SB19.2 SB122.2 SB127.2
PG10: CN13.2 SB10.1 SB118.1  [also labelled SMPS_V1]
PG11: CN13.4 SB16.2  [also labelled SMPS_EN]
PG12: CN13.8 SB18.2  [also labelled SMPS_PG]
PG13: CN13.6 SB17.2  [also labelled SMPS_SW]
VOUTCORE: CN13.5 SB3.2 SB4.2
VOUTVDD: CN13.3 SB19.1
NetC21_2: C21.2 L1.2 R34.1 SB7.1 U9.5(VOUT) U15.C2(FB)
NetC22_2: C22.2 C23.1 SB8.1 SB113.1 SB116.2 SB117.2 SB129.2 U9.2(VIN) U15.A2(PVIN)
NetC24_1: C24.1 C25.2 SB120.2 SB121.2 U10.A3(VIN) U10.B2(EN) U16.A2(PVIN) U16.A3(EN)
NetC46_2: C46.2 SB11.1 U9.6(VOUT2)
NetC47_2: C47.2 L2.2 SB127.1 U10.E3(VOUT) U16.C2(FB)
NetC48_1: C48.1 SB16.1 SB129.1 U9.12(EN) U15.A3(EN)
NetL1_1: L1.1 U9.3(SW) U15.A1(SW)
NetL2_1: L2.1 U10.C3(SW) U16.A1(SW)
NetR32_1: R32.1 SB17.1 U7.4(2IN) U7.9(1IN) U9.1(AUX)
NetR33_2: R33.2 U9.8(CTRL)
NetR34_2: R34.2 SB18.1 U9.7(PG) U15.C1(VOUTOK)
NetR35_2: R35.2 U16.C3(VID)
NetR53_2: R53.2 SB113.2 U15.C3(VID)
NetSB1_1: SB1.1 U7.3(VCC)
NetSB2_1: SB2.1 U7.2(1S1) U7.7(2S1)
NetSB4_1: SB4.1 SB7.2 U7.5(D2) U7.10(D1)
NetSB9_2: SB9.2 SB10.2 U9.9(D0)
NetSB114_2: SB114.2 SB116.1 U15.B3(SYNC/MODE)
NetSB115_2: SB115.2 SB117.1 SB118.2 U9.10(D1)
NetSB120_1: SB120.1 SB125.2 U16.B3(SYNC/MODE)

Not connected (* = marked no-connect by the designer): U7 1(1S2)* 6(2S2)*; U10 E1(PG)*; U16 C1(VOUTOK)*

### Buses and harness runs
bus PG[0..15] = port PG[0..15]

### Notes on the sheet
- U10 and U16 are exclusive
- (near SB1) SB1
  Closed:Default
  Open:
  If external switch (U7)  is needed
- (near SB8) SB8
  Closed: Default
  Open: If  using External SMPS on CN13
- (near SB3) SB3
  Open: Default
  Closed: If  using External SMPS on CN13 and U7 is not needed
- Default volatge will be Vout = 1.2V
  BUT Some board to be equiped with ADP5301_Opt1 and R53=25.5K for Vout = 1.1V
- (near SB4) SB4
  Open: Default
  Closed: If  using External SMPS on CN13 and U7 is needed
- (near SB2) SB2
  Closed:Default
  Open:
  If external switch (U7)  is needed
- U9 and U15 are exclusively populated
- (near SB7) SB7
  Closed:If ADI5301(U15) is used or ST1PS02(U9) VOUT is used
  Open: If ST1PS02(U9) VOUT2 is used
- (near SB117) Mode        SB10  SB118  SB115  SB117  SB9   Volt   Ivdd
  ST1PS02D
  Default     Open   Open   Open   Closed  Closed   1.25    na
  DualVlow Closed  Open  Closed  Open  Open 1.05/1.15 50
  DualVhi    Open  Closed  Open  Open  Closed  1.05/1.25 100
- Solder bridges default setting
  ADI5301(U15):
  Closed: SB1, SB2, SB7, SB8, SB16, SB17, SB18, SB114
  Open: SB3, SB4, SB9, SB10, SB11, SB113, SB115, SB116, SB117, SB118, SB129
  ST1PS02(U9):
  Closed: SB8, SB9, SB11, SB16, SB17, SB18, SB117
  Open: SB1, SB2, SB3, SB4, SB7, SB10, SB113, SB114, SB115, SB116, SB118, SB129
- (near SB11) SB11:
  Closed: If ST1PS02 (U9) VOUT2 is used
  Open: If ADI5301(U15) is used or ST1PS02(U9) VOUT is used
- Title:
- Project:
- Size:
- Date:
- A3
- Reference:
- Sheet:
- Revision:
- of

### Library data of the parts
C21 C22 C25 C46 C47 = Cap: Capacitor; Value: 10nF; Published: 8-Jun-2000; Revision: July-2002: Re-released for DXP Platform.; Publisher: Altium Limited
C23 C24 C48 = CAP_CC0603KRX7R9BB104: Capacitor SMD 0603 100000pF X7R 50V +/-10%; Manufacturer: YAGEO; Order code RS: 669-8767; Tolerance: 10%; Fitted: Yes; Manufacturer P/N: CC0603KRX7R9BB104; Order code Farnell: 1362556; Value: 100nF; Rated voltage: 50V; Technology: X7R; Temperature Max: +125癈; Temperature Min: -55癈; Order code Digikey: 311-1344-2-ND
CN13 = Header 4X2_CN: Header, 4-Pin, Dual row; Revision: 17-Jul-2002: Re-released for DXP Platform.; Publisher: Altium Limited
L1 L2 = Inductor: Manuf_1: TDK; Value: 2.2uH; Ordered by: Subcon; ECCN_US/EU: NA; Published: 8-Jun-2000; Revision: July-2002: Re-released for DXP Platform.; Publisher: Altium Limited; Manuf_Part_1: VLS252010HBX-2R2M-1
R32-R34 = Res1: Resistor; Value: 1K; Published: 8-Jun-2000; Revision: July-2002: Re-released for DXP Platform.; Publisher: Altium Limited
R35 R53 = res1: Resistor; Value: 1K; Published: 8-Jun-2000; Revision: July-2002: Re-released for DXP Platform.; Publisher: Altium Limited
SB1-SB4 SB7-SB11 SB16-SB18 SB115 SB117 SB118 = Circuit Breaker: Solder: NO; Published: 24-Mar-1999; Revision: July-2002: Re-released for DXP Platform.; Publisher: Altium Limited
SB19 SB113 SB116 SB120 SB121 SB127 SB129 = Circuit Breaker: Published: 24-Mar-1999; Revision: July-2002: Re-released for DXP Platform.; Publisher: Altium Limited
SB114 SB122 SB125 = Circuit Breaker_close: Circuit Breaker; Published: 24-Mar-1999; Revision: July-2002: Re-released for DXP Platform.; Publisher: Altium Limited
U7 = STG3684AUTR: Low voltage 0.5 O max dual SPDT switch with break-before-make; Manufacturer: ST; Order code RS: ...; Fitted: Yes; Manufacturer P/N: STG3684AUTR; Order code Farnell: ...; Temperature Min: -40癈; Temperature Max: +85癈; Order code Digikey: ...
U9 = ST1PS022D1QTR: 400mA Nano-Quiescent?Synchronous step-down converter  with voltage selection, power good, Aux Switch; Manufacturer: STMicroelectronics; Order code RS: ...; Manufacturer P/N: ST1PS02; Order code Farnell: ...
U10 = ST1PS01FJR: 400mA Nano-Quiescent?Synchronous step-down converter  with voltage selection and power good; Manufacturer: STMicroelectronics; Manufacturer P/N: ST1PS01EJR
U15 U16 = ADP5301: UL Step down regulator